# Altium schematic sheet IPG-V1_rev0.24.SchDoc (part 1 of 3)
size E; CompanyName: Medipace Inc.; Address2: Pasadena, CA; Address3: USA; Revision: 1
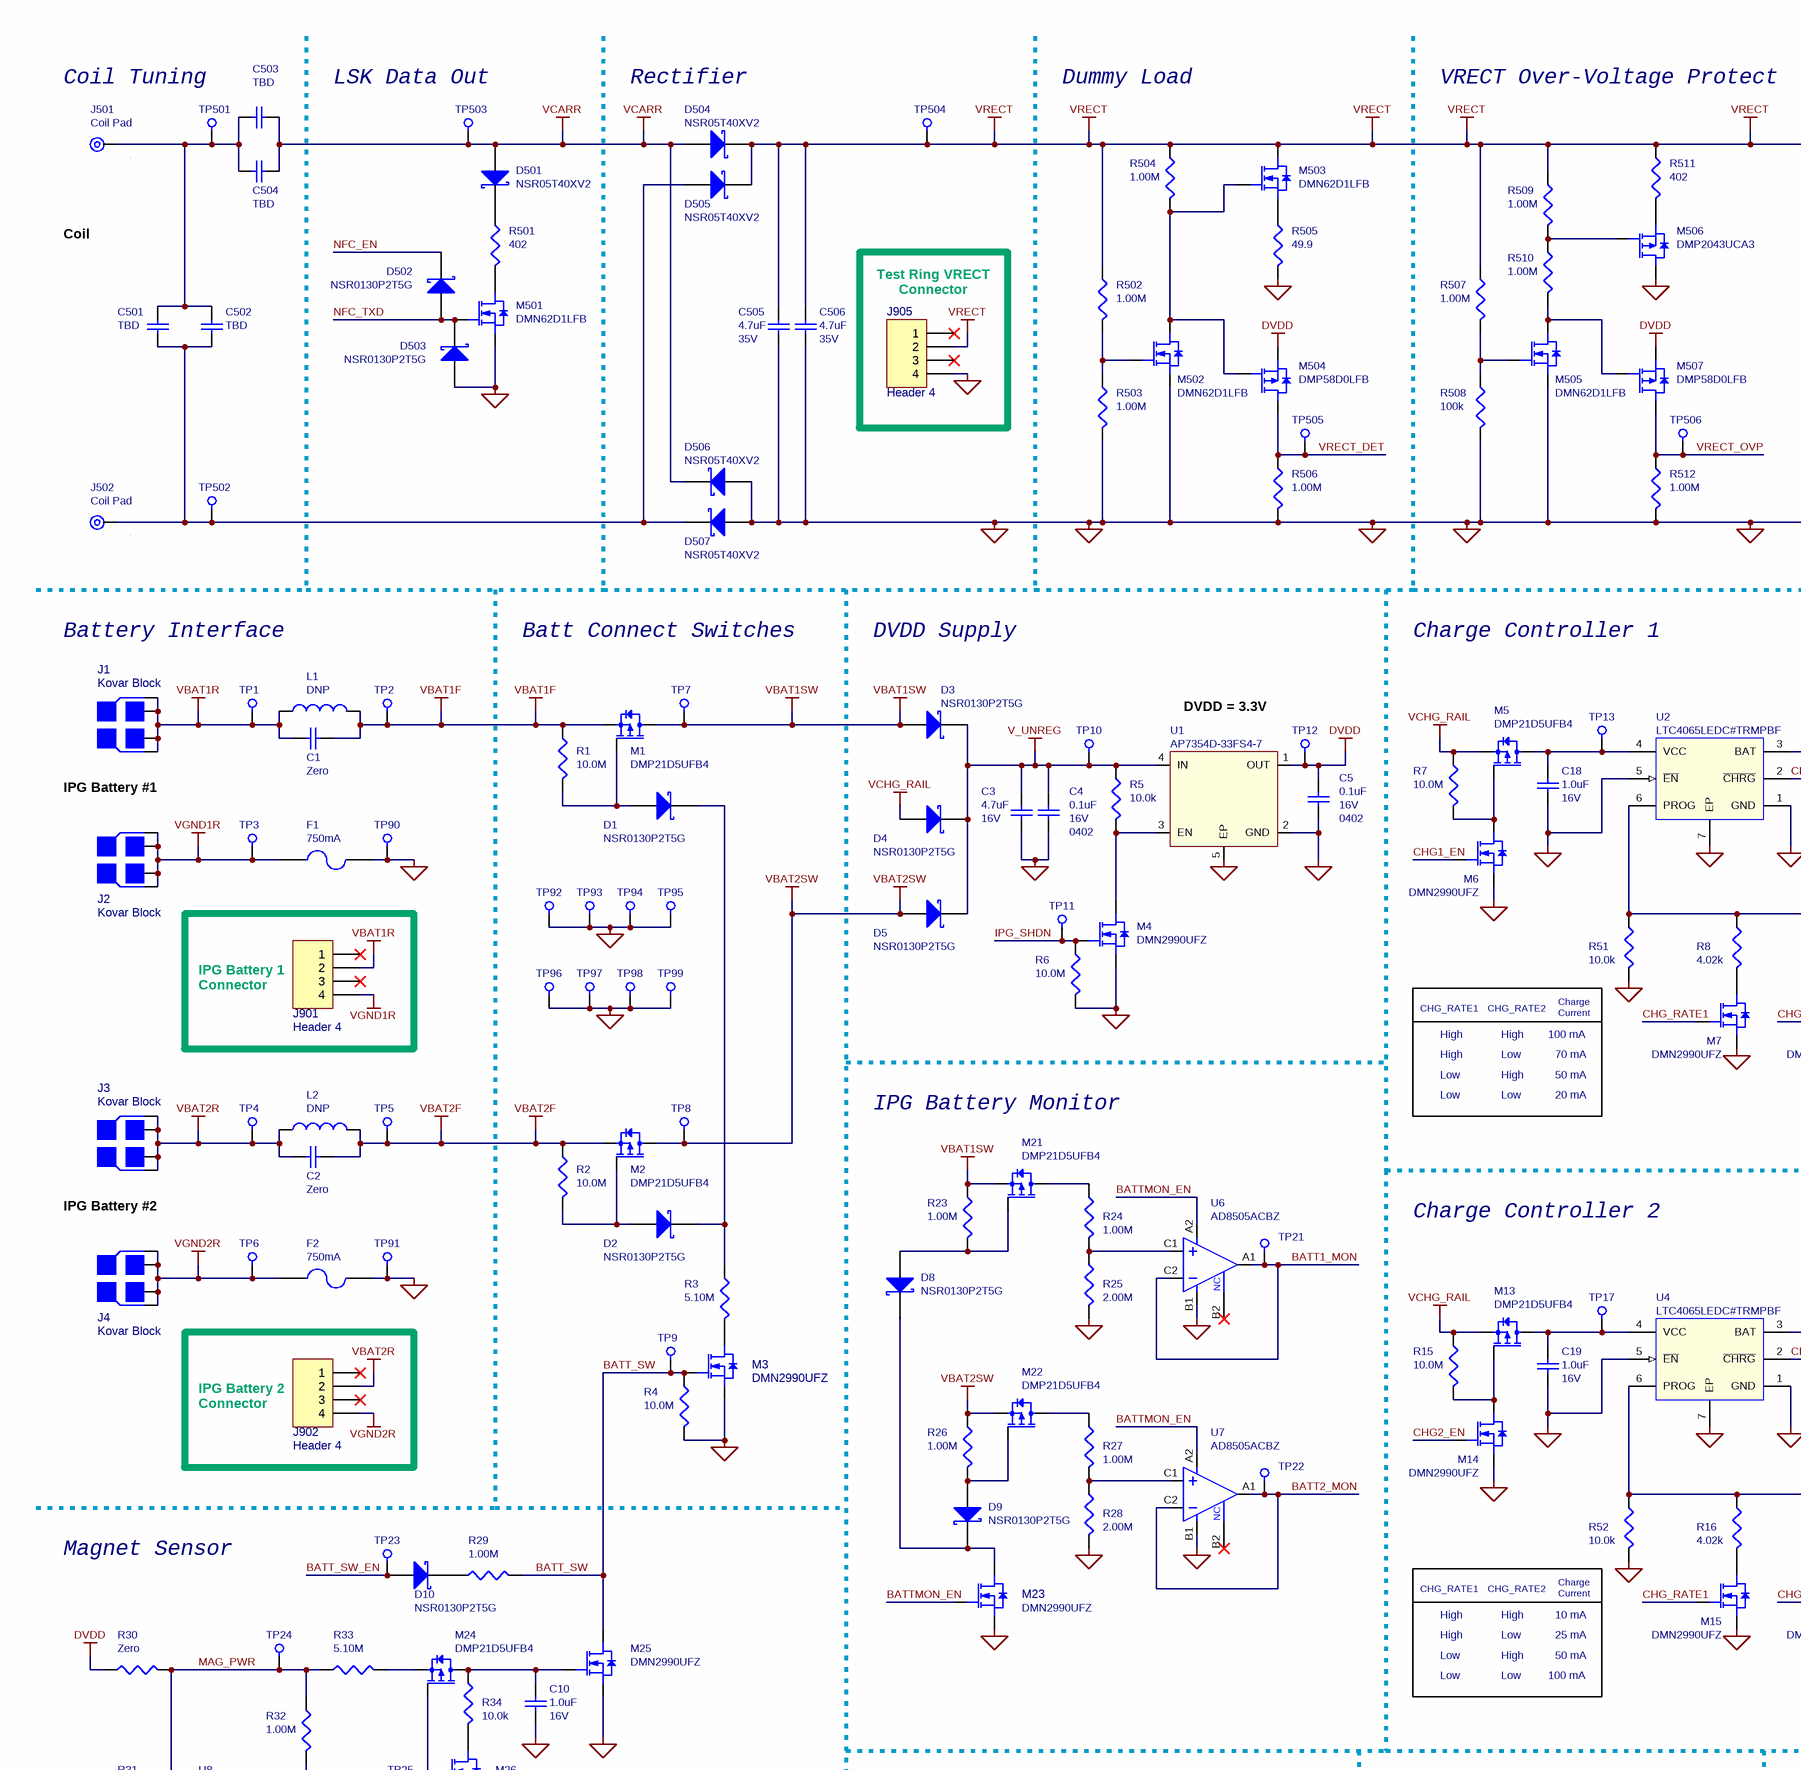
[diagram p0: IPG-V1_rev0.24.SchDoc, top left]
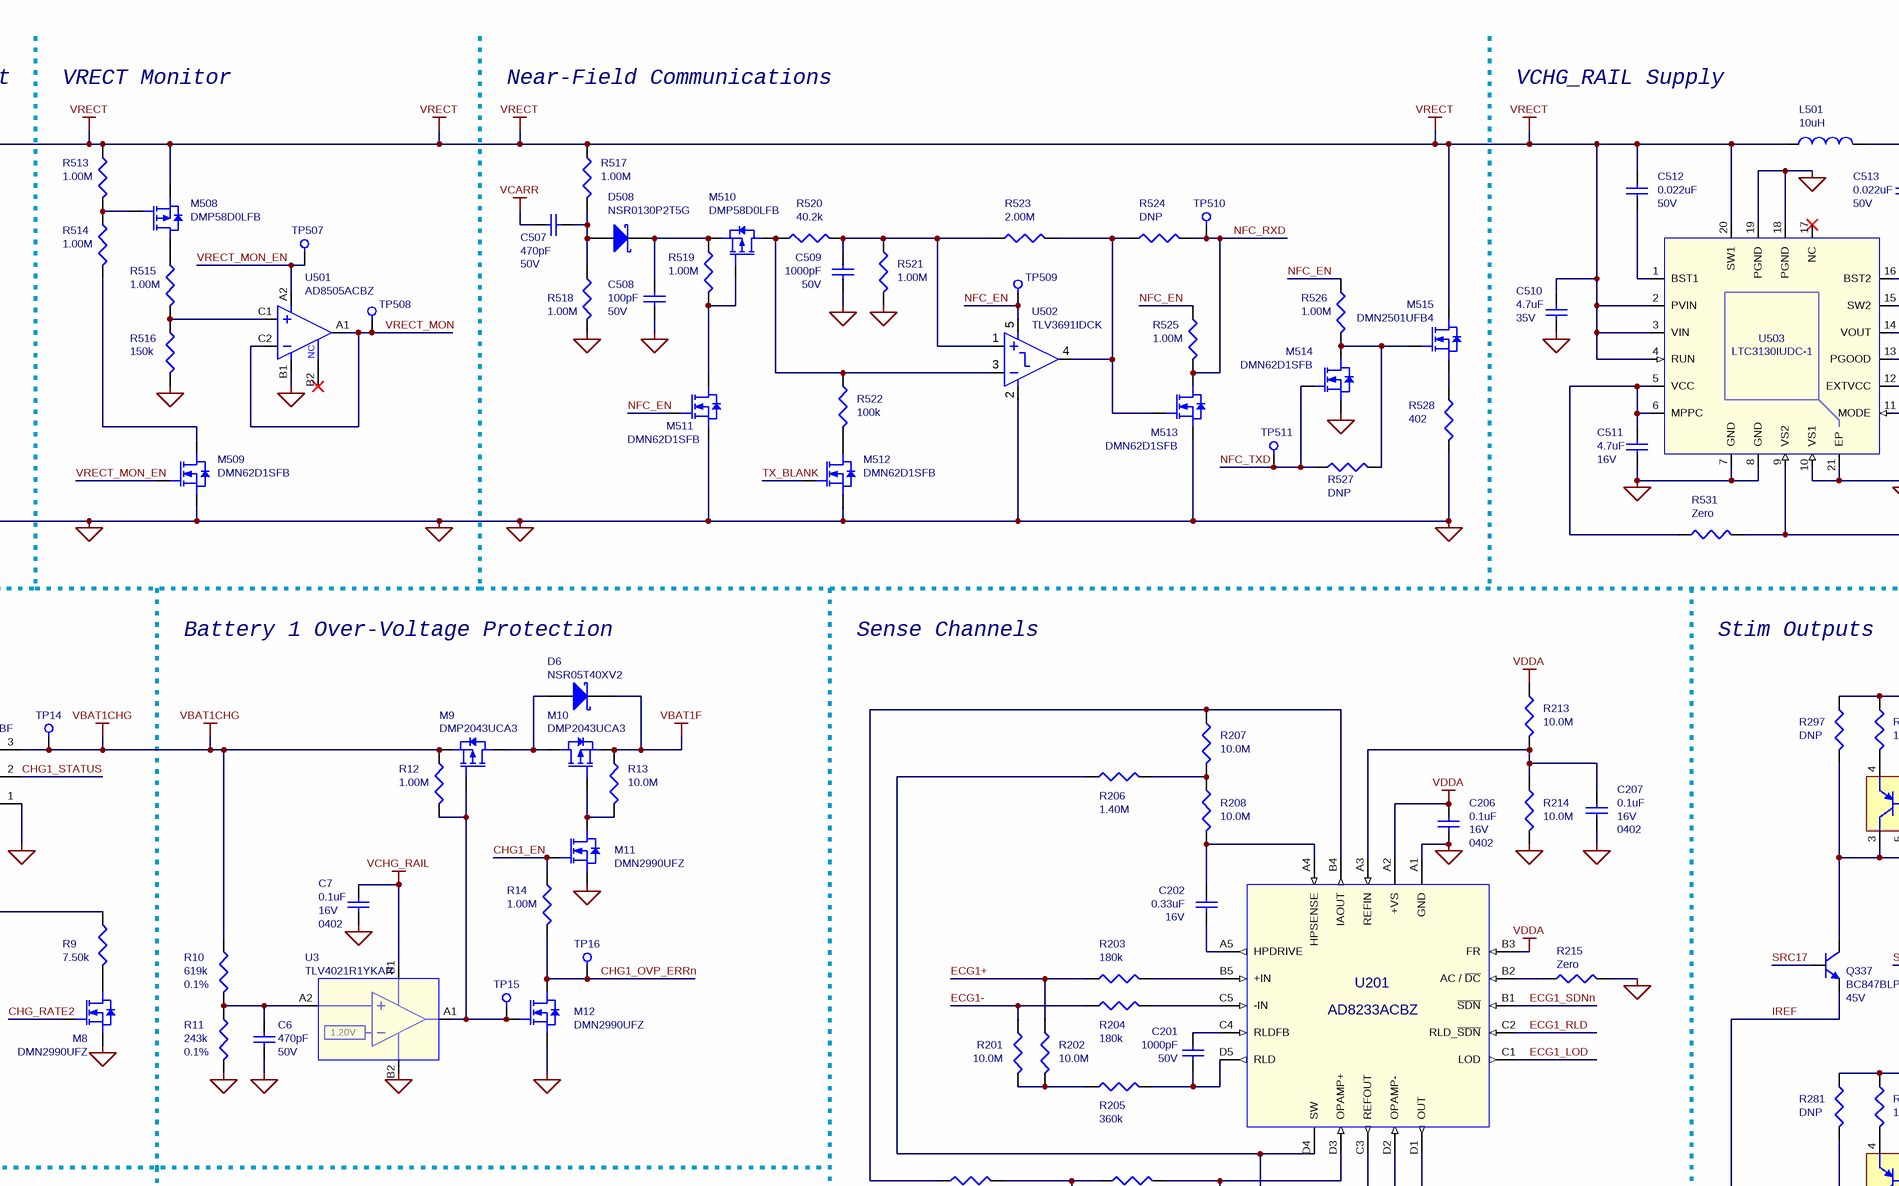
[diagram p1: IPG-V1_rev0.24.SchDoc, top middle]
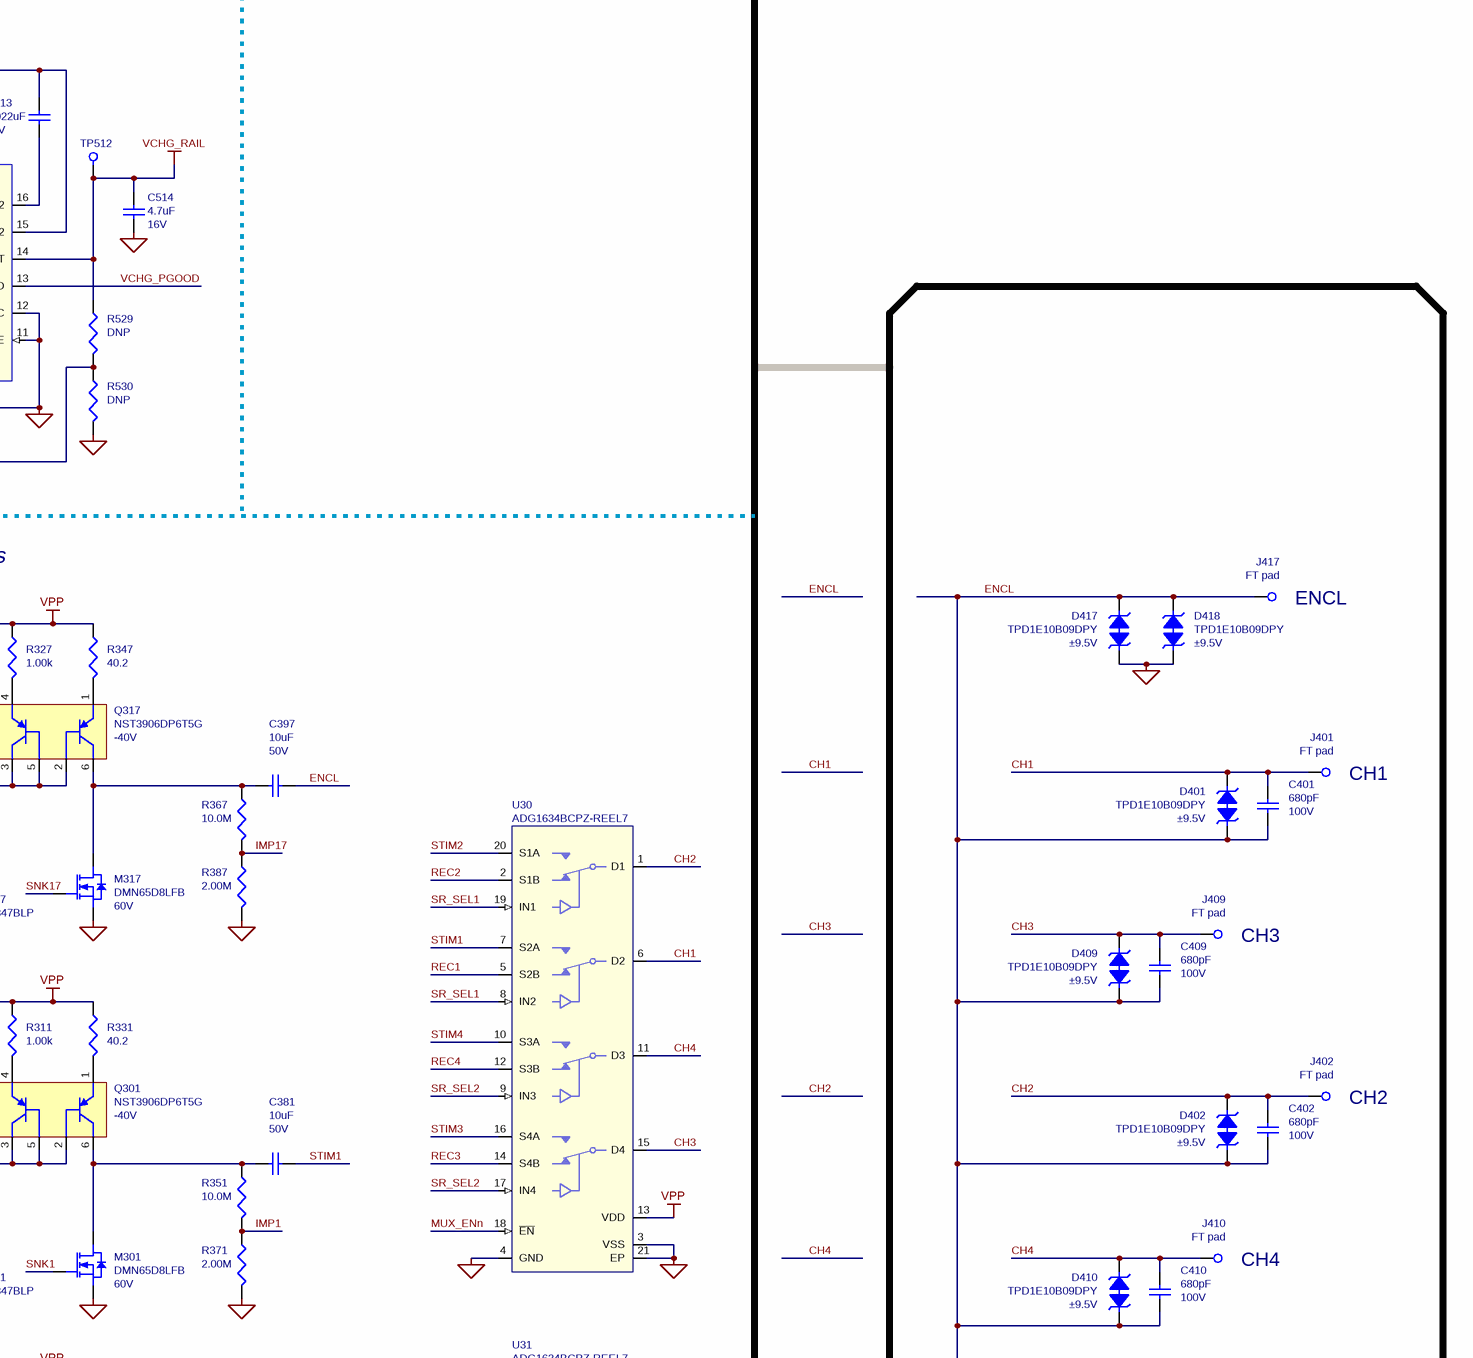
[diagram p2: IPG-V1_rev0.24.SchDoc, top right]
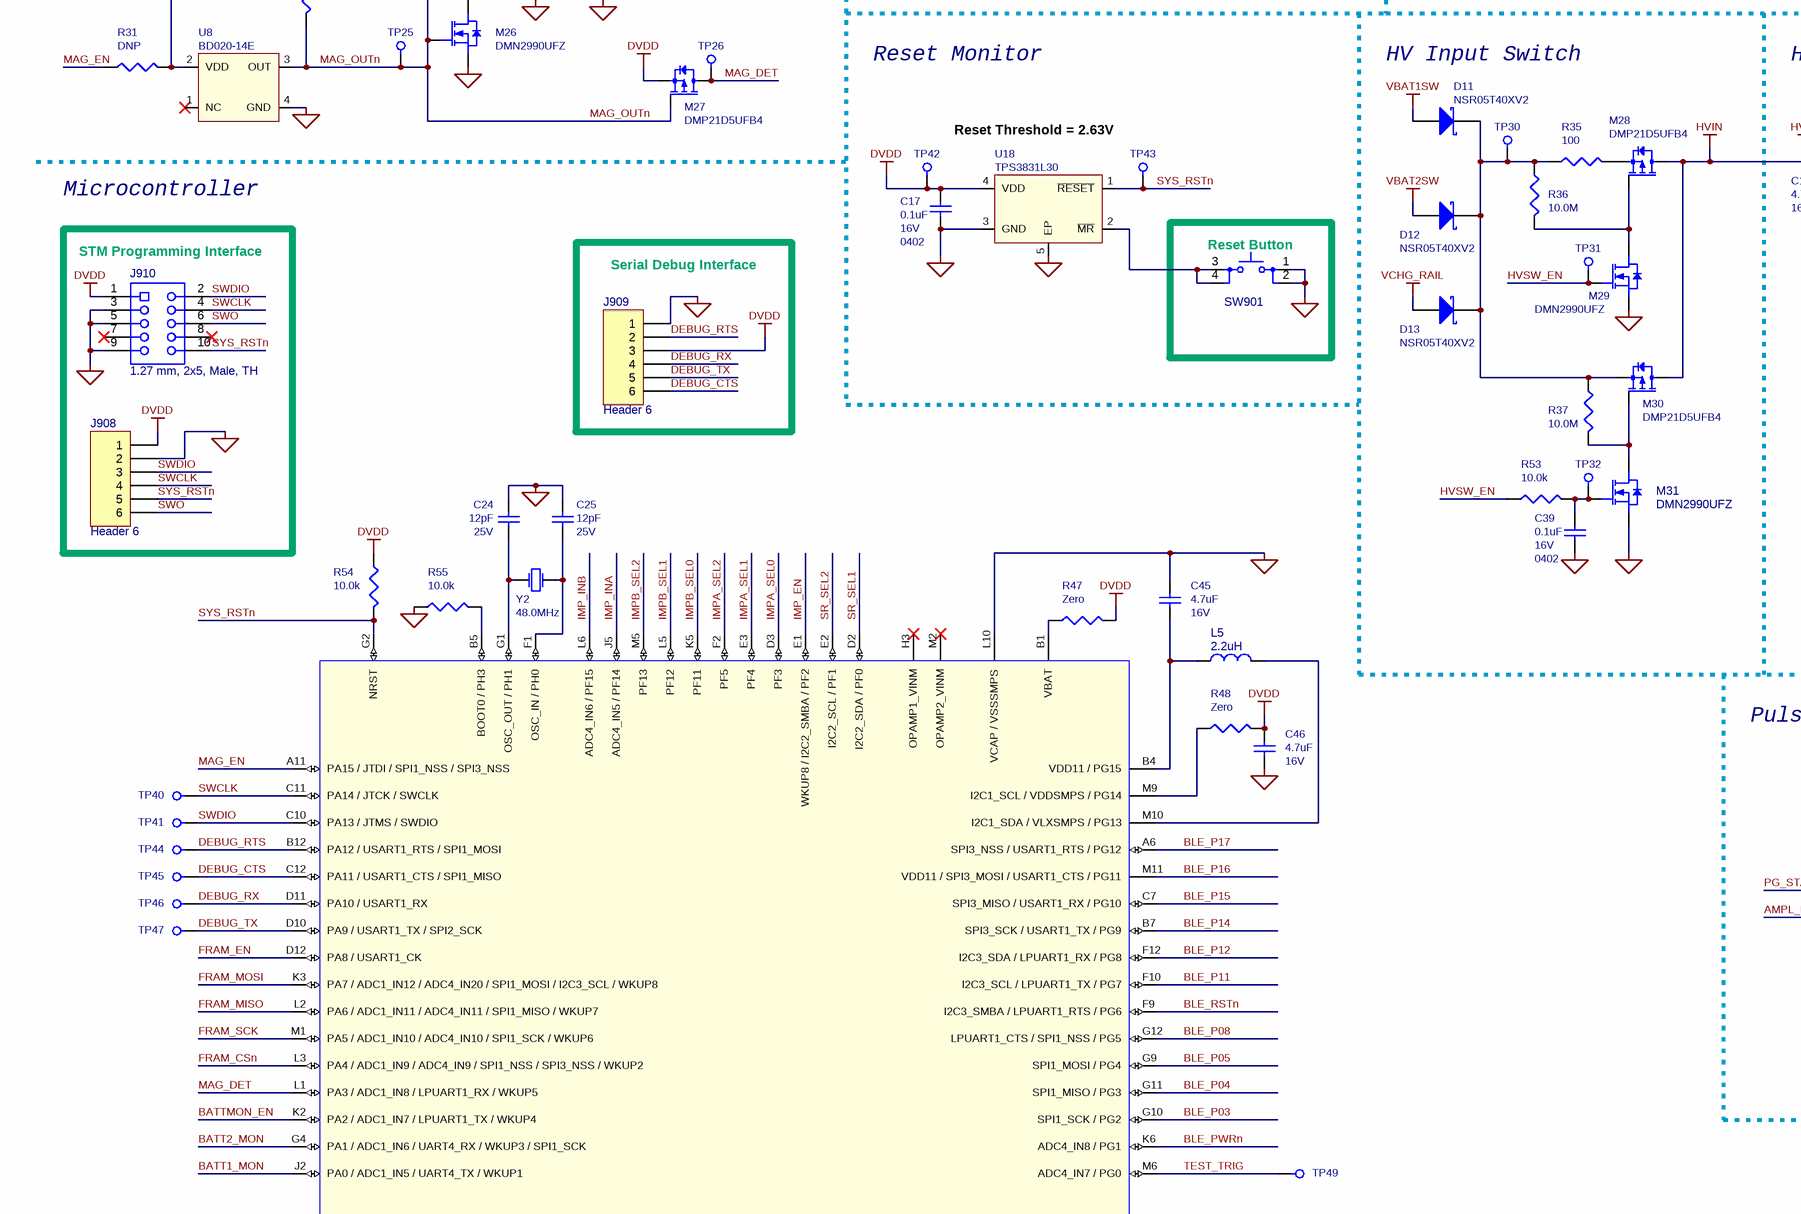
[diagram p3: IPG-V1_rev0.24.SchDoc, centre left]
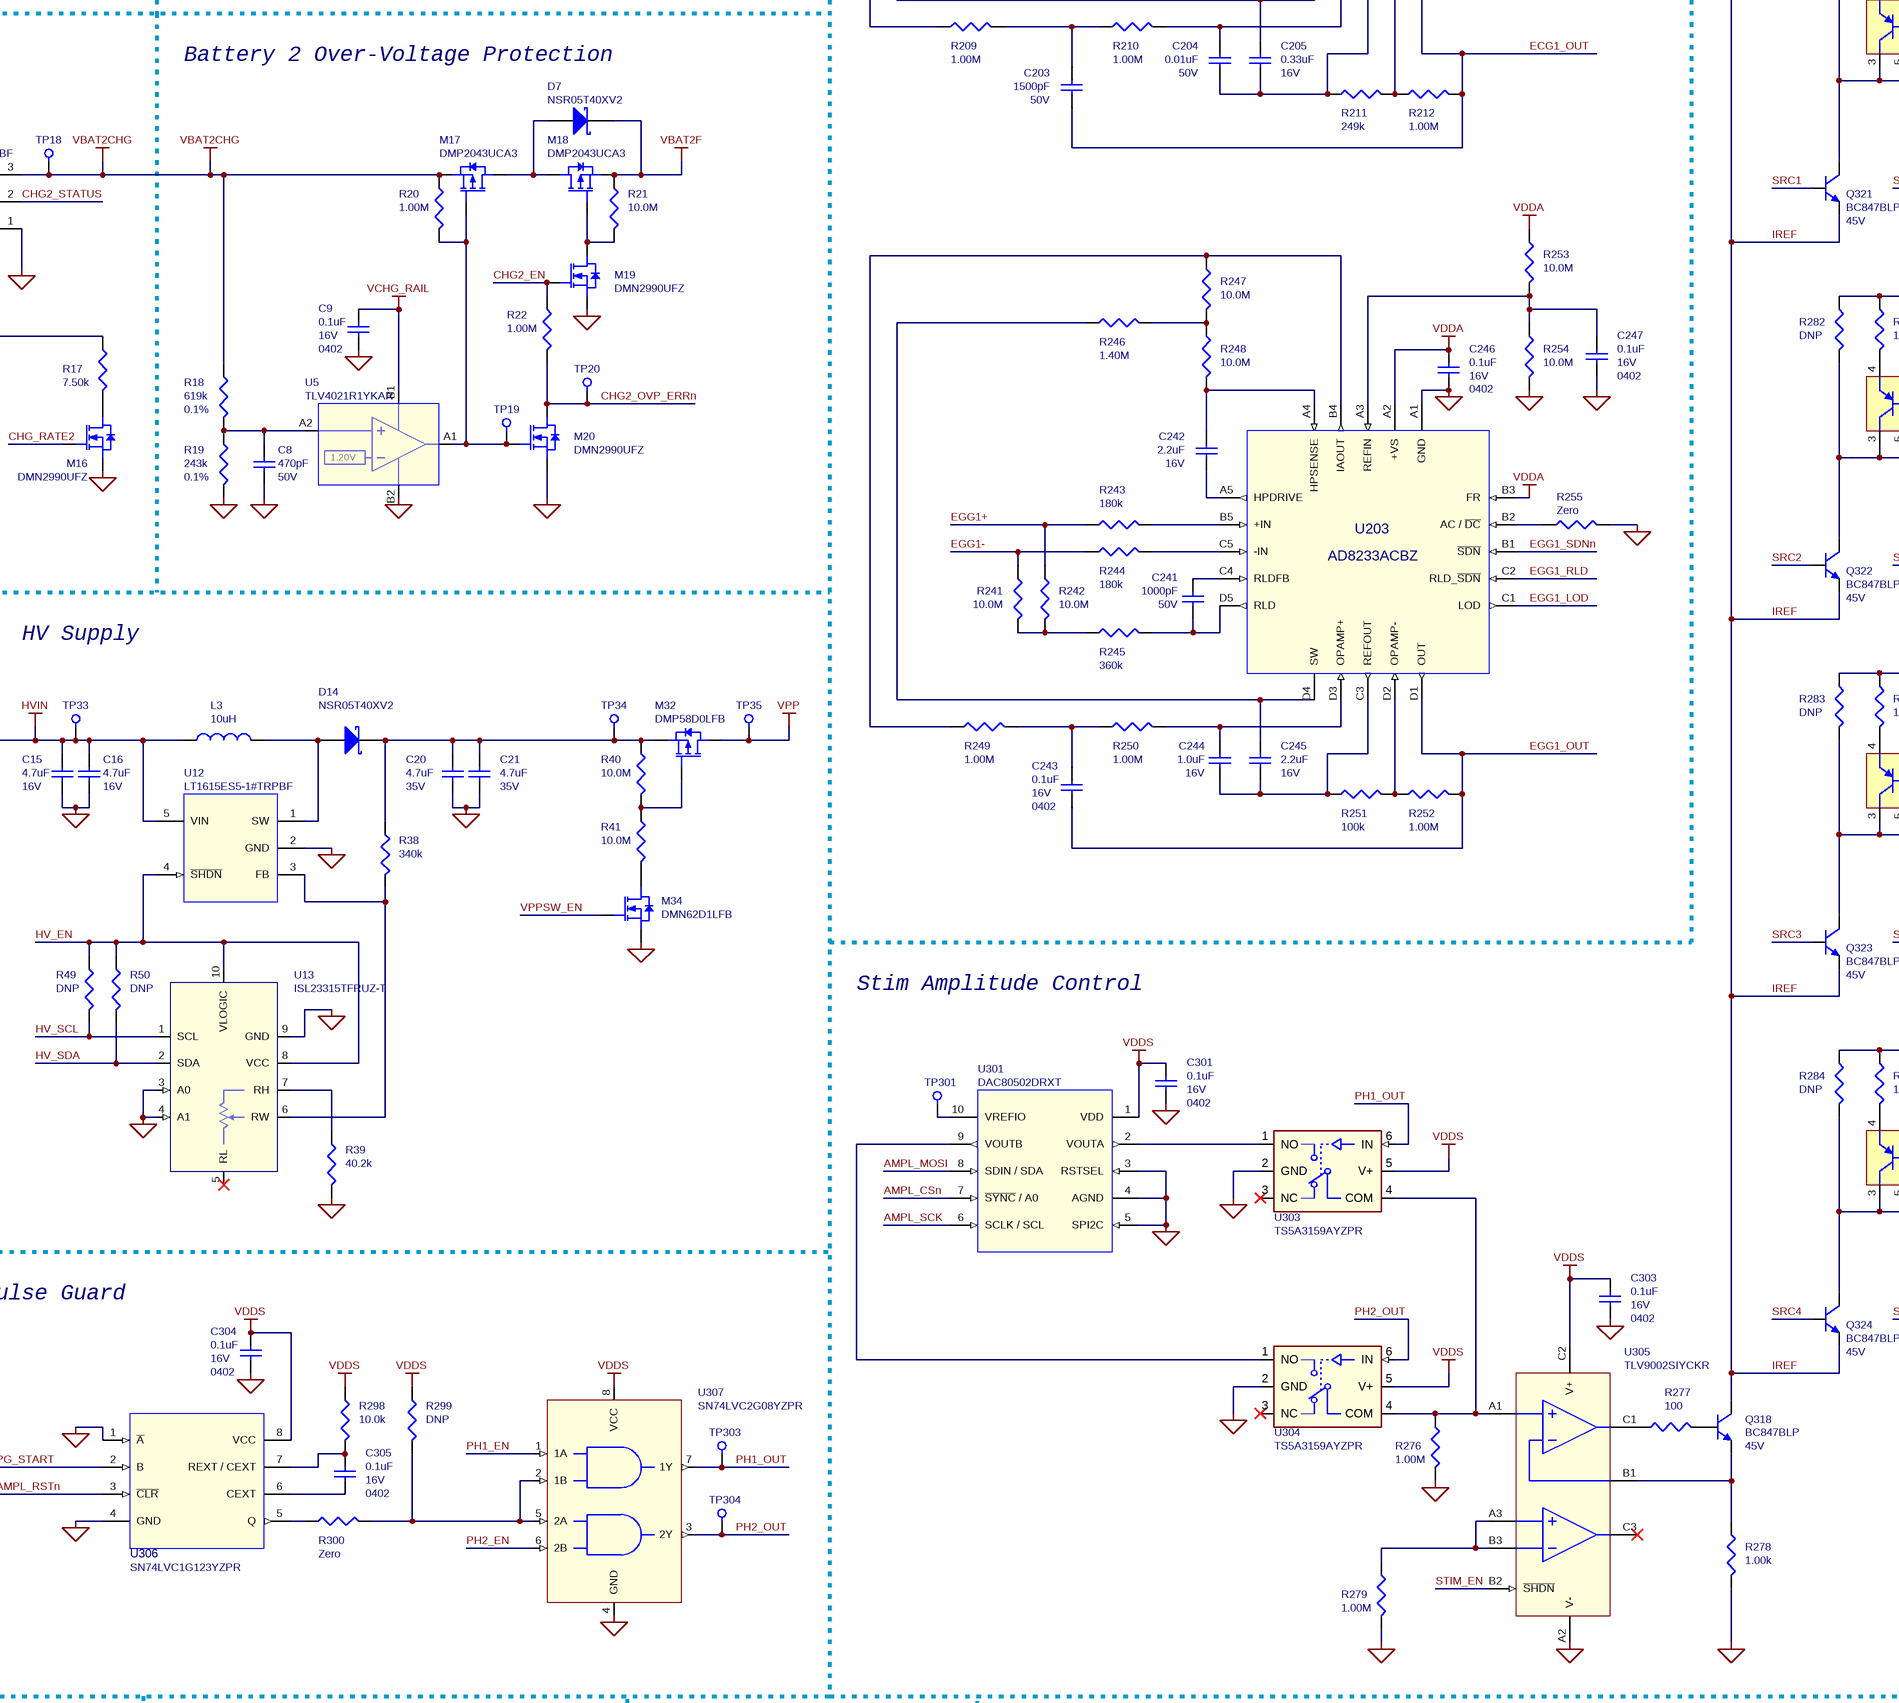
[diagram p4: IPG-V1_rev0.24.SchDoc, centre middle]
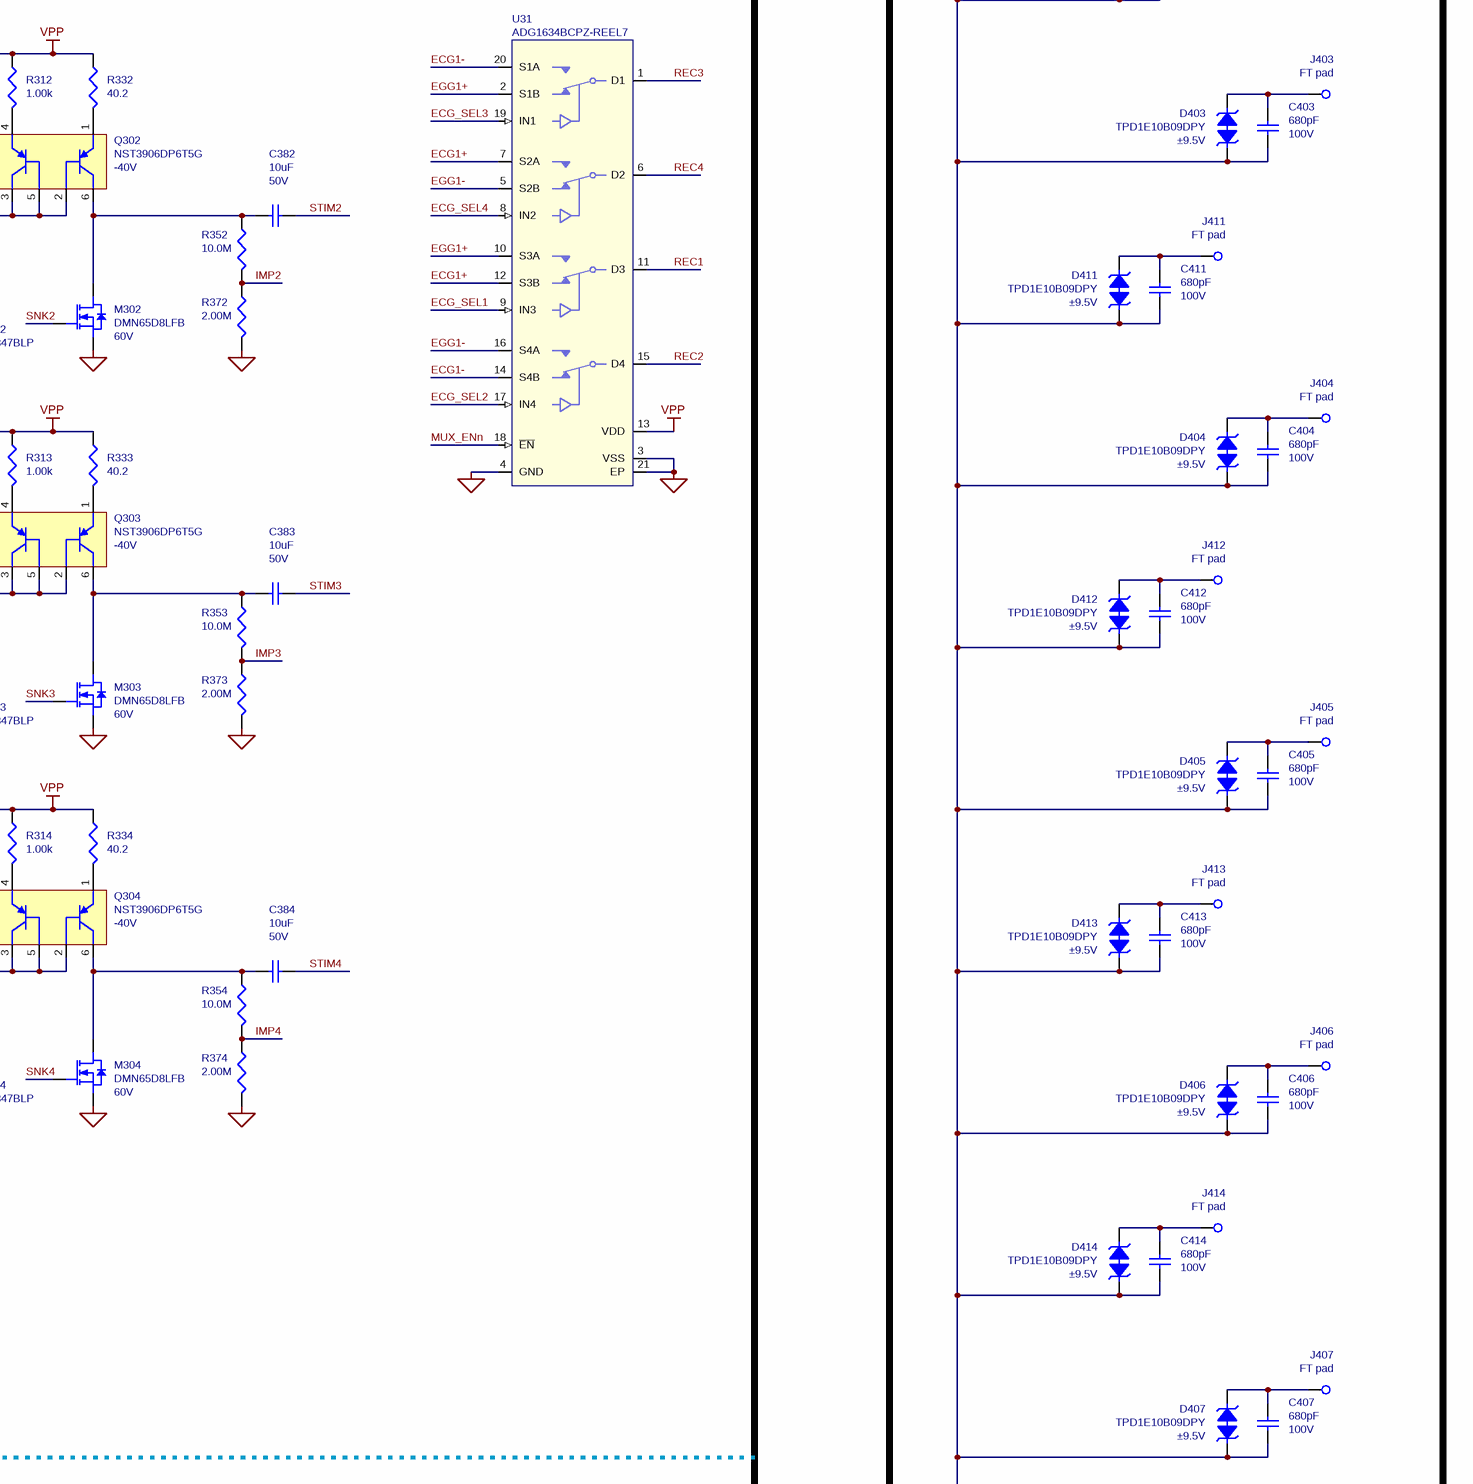
[diagram p5: IPG-V1_rev0.24.SchDoc, centre right]
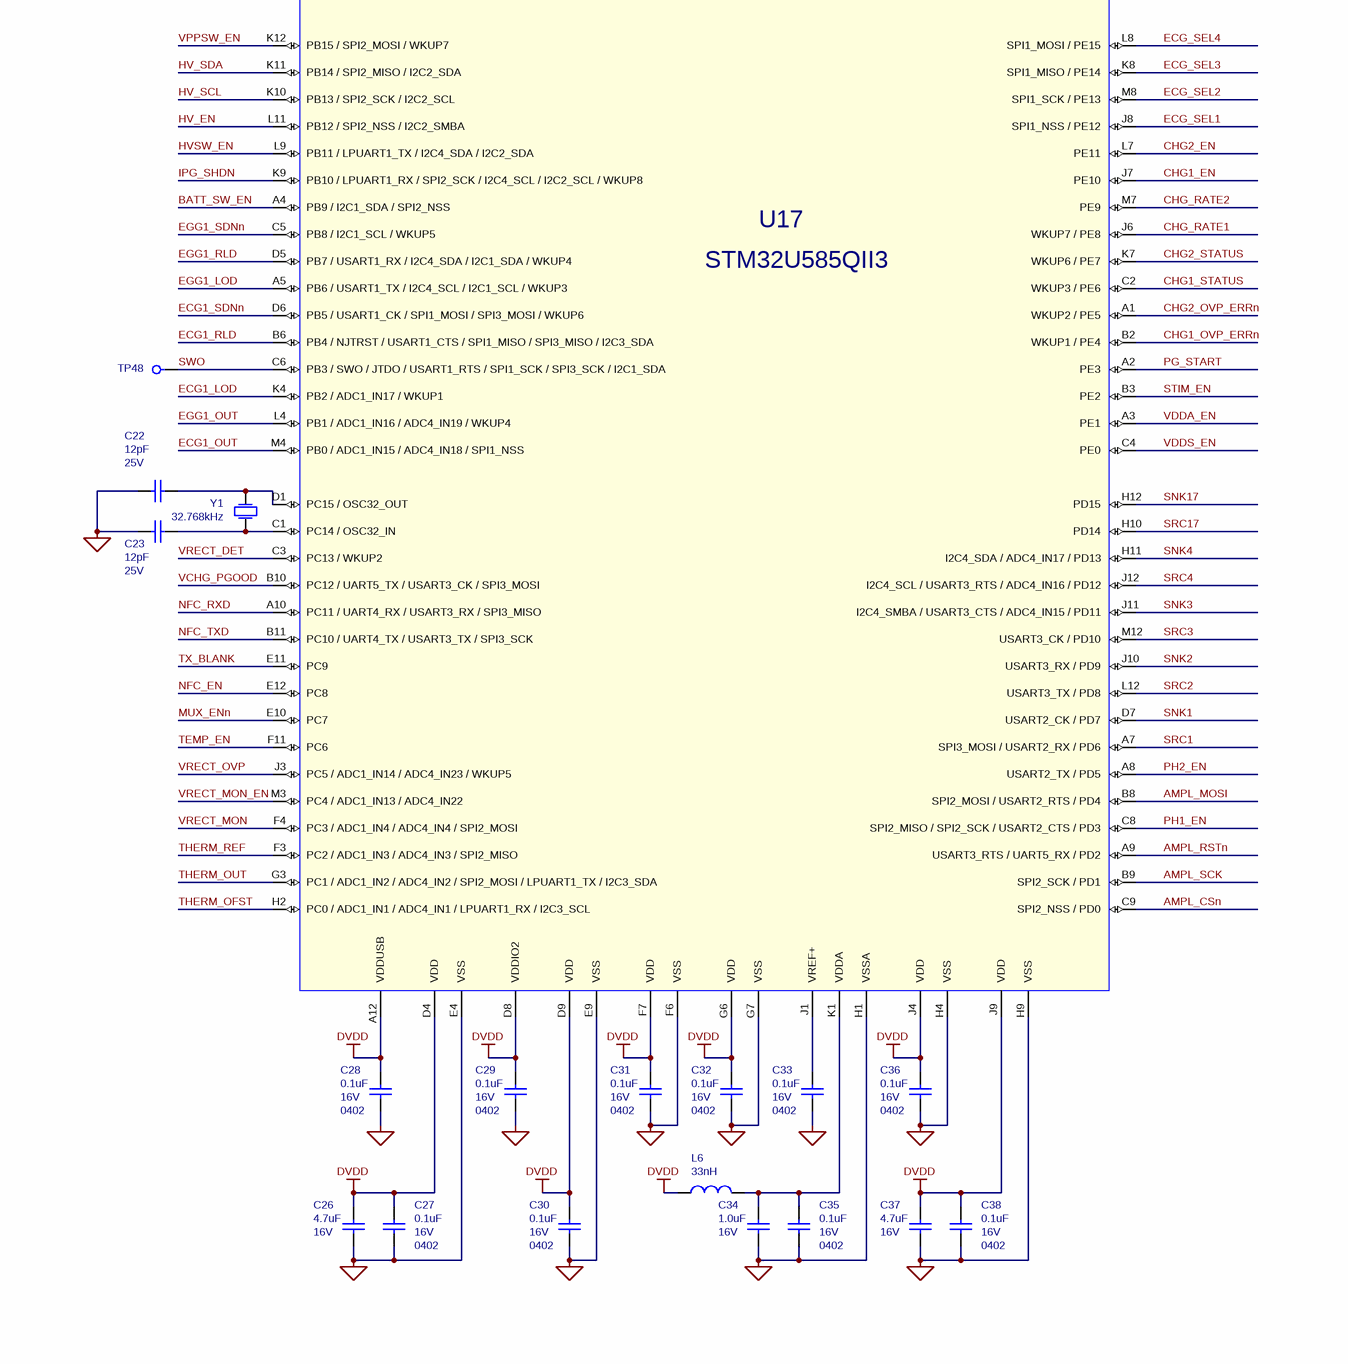
[diagram p6: IPG-V1_rev0.24.SchDoc, bottom left]
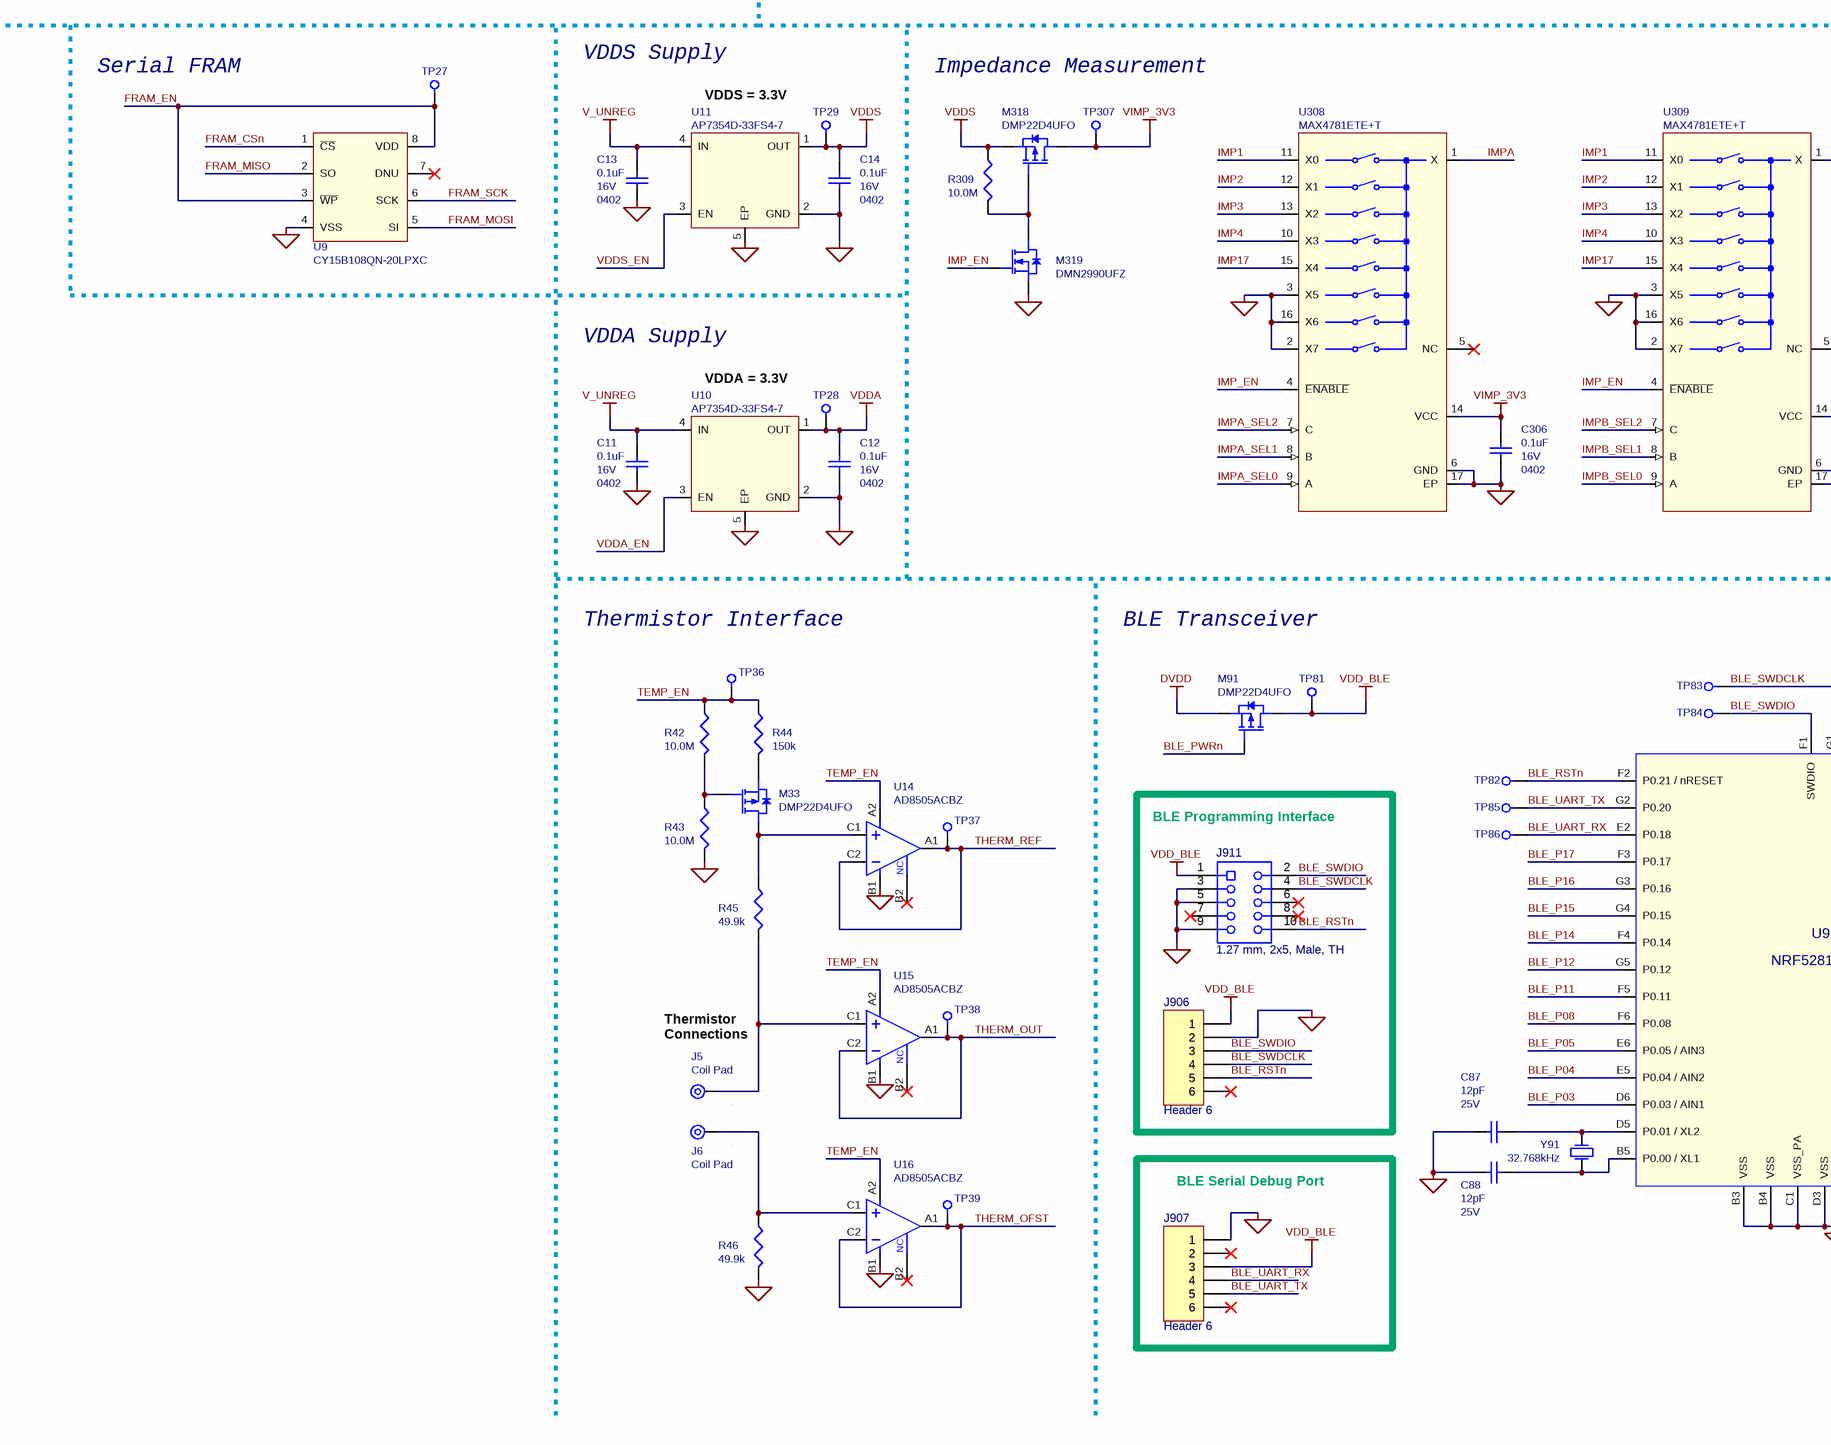
[diagram p7: IPG-V1_rev0.24.SchDoc, bottom middle]
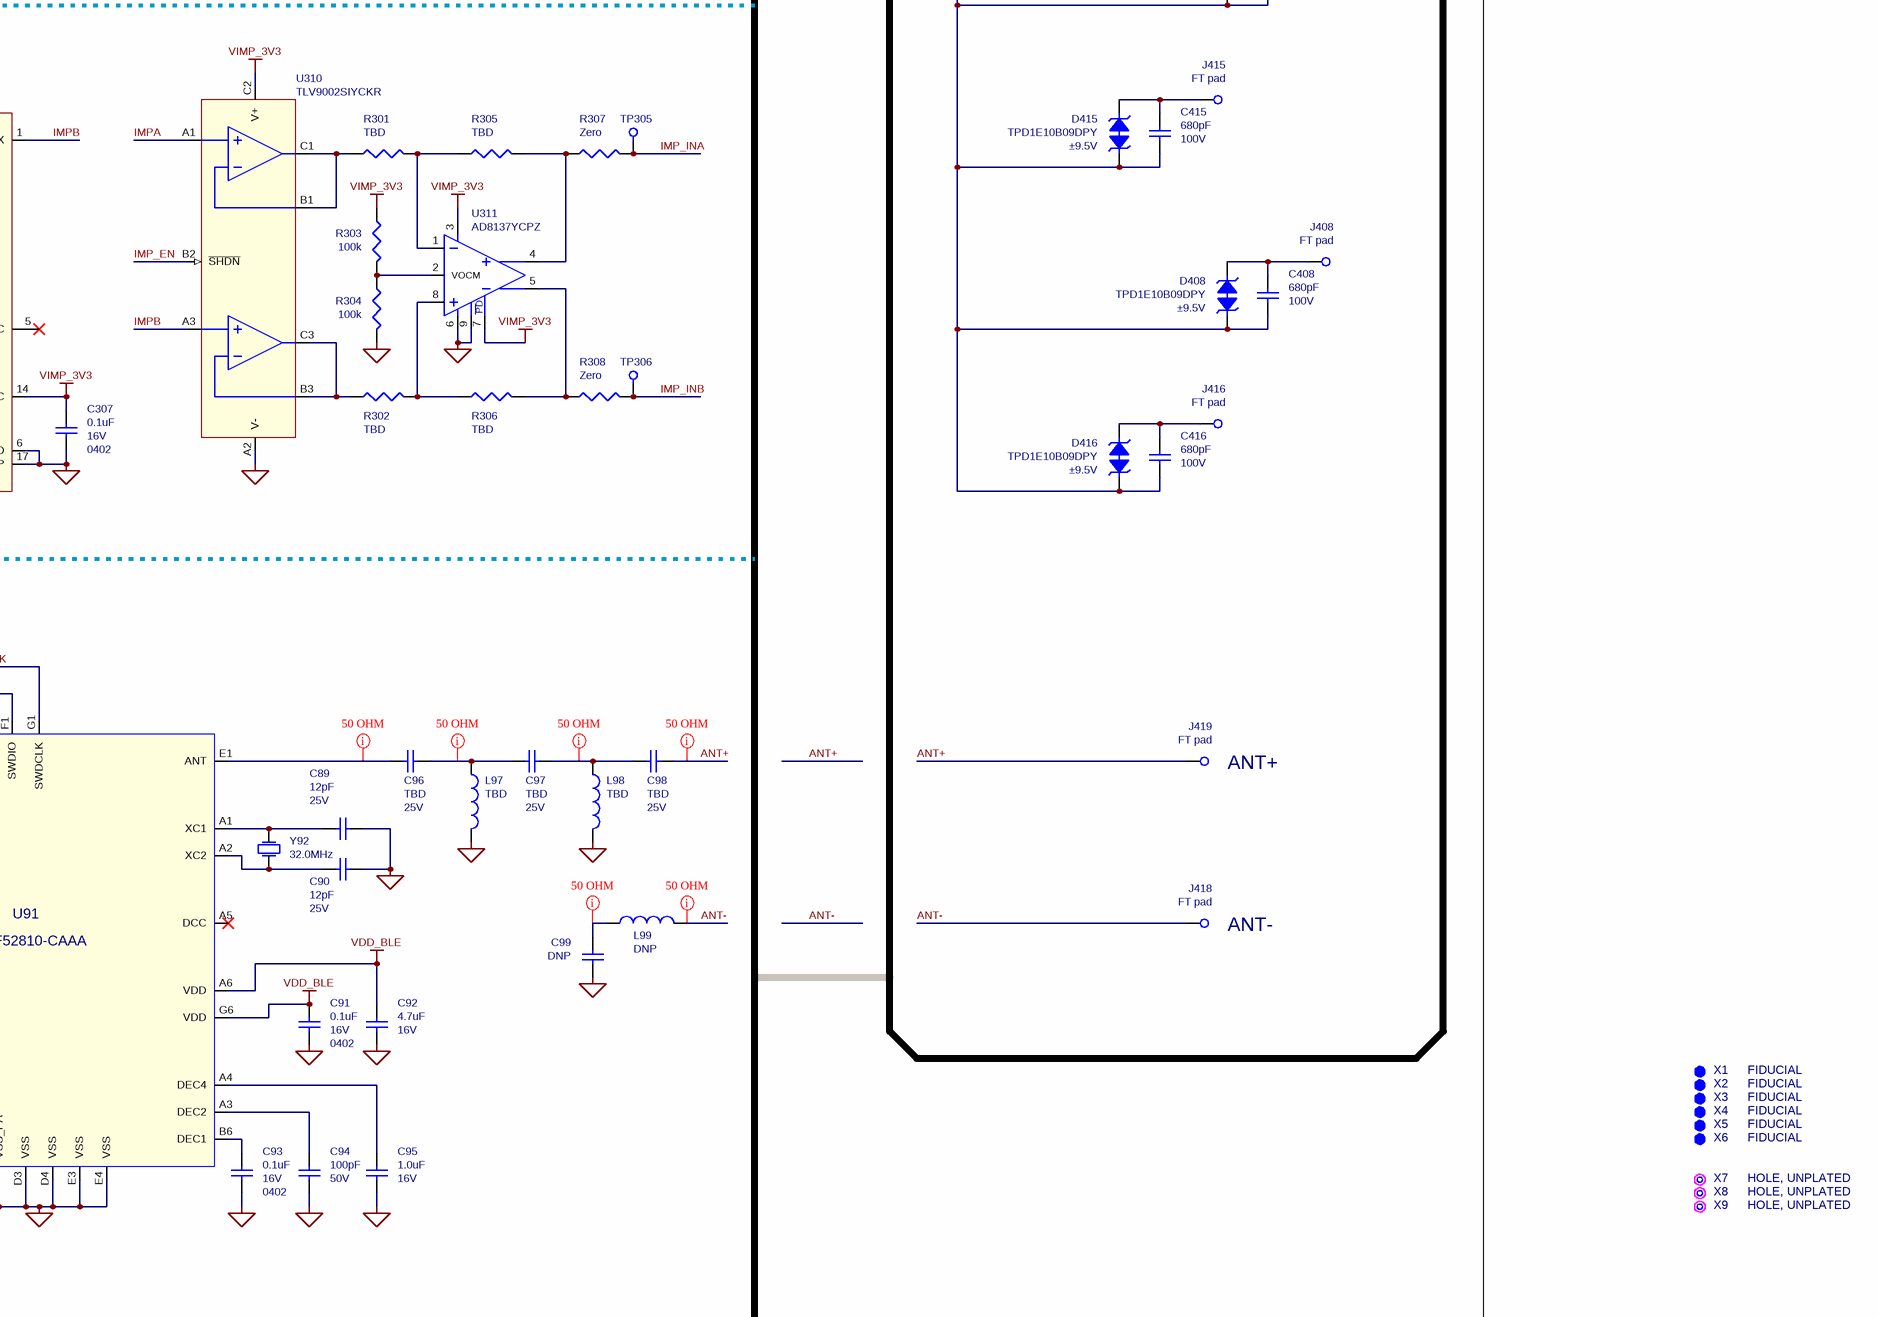
[diagram p8: IPG-V1_rev0.24.SchDoc, bottom right]

## Parts
C1  value Zero  [CAP0402_REDUCED]  (hidden comment: Capacitor, Zero ohms, 0402)
C2  value Zero  [CAP0402_REDUCED]  (hidden comment: Capacitor, Zero ohms, 0402)
C3  value 4.7uF  Rating: 16V  [CAP0603_REDUCED]  (hidden comment: GCH188R61C475KE11)
C4  value 0.1uF  Rating: 16V  Package Description: 0402  [CAP0402_REDUCED]  (hidden comment: GCH155R71C104KE01)
C5  value 0.1uF  Rating: 16V  Package Description: 0402  [CAP0402_REDUCED]  (hidden comment: GCH155R71C104KE01)
C6  value 470pF  Rating: 50V  [CAP0402_REDUCED]  (hidden comment: GCH155R71H471KE01)
C7  value 0.1uF  Rating: 16V  Package Description: 0402  [CAP0402_REDUCED]  (hidden comment: GCH155R71C104KE01)
C8  value 470pF  Rating: 50V  [CAP0402_REDUCED]  (hidden comment: GCH155R71H471KE01)
C9  value 0.1uF  Rating: 16V  Package Description: 0402  [CAP0402_REDUCED]  (hidden comment: GCH155R71C104KE01)
C10  value 1.0uF  Rating: 16V  [CAP0603_REDUCED]  (hidden comment: GCH188R71C105KE01)
C11  value 0.1uF  Rating: 16V  Package Description: 0402  [CAP0402_REDUCED]  (hidden comment: GCH155R71C104KE01)
C12  value 0.1uF  Rating: 16V  Package Description: 0402  [CAP0402_REDUCED]  (hidden comment: GCH155R71C104KE01)
C13  value 0.1uF  Rating: 16V  Package Description: 0402  [CAP0402_REDUCED]  (hidden comment: GCH155R71C104KE01)
C14  value 0.1uF  Rating: 16V  Package Description: 0402  [CAP0402_REDUCED]  (hidden comment: GCH155R71C104KE01)
C15  value 4.7uF  Rating: 16V  [CAP0603_REDUCED]  (hidden comment: GCH188R61C475KE11)
C16  value 4.7uF  Rating: 16V  [CAP0603_REDUCED]  (hidden comment: GCH188R61C475KE11)
C17  value 0.1uF  Rating: 16V  Package Description: 0402  [CAP0402_REDUCED]  (hidden comment: GCH155R71C104KE01)
C18  value 1.0uF  Rating: 16V  [CAP0603_REDUCED]  (hidden comment: GCH188R71C105KE01)
C19  value 1.0uF  Rating: 16V  [CAP0603_REDUCED]  (hidden comment: GCH188R71C105KE01)
C20  value 4.7uF  Rating: 35V  [CAP0805_REDUCED]  (hidden comment: GCH21BC7YA475KE11)
C21  value 4.7uF  Rating: 35V  [CAP0805_REDUCED]  (hidden comment: GCH21BC7YA475KE11)
C22  value 12pF  Rating: 25V  [CAP0402_REDUCED]  (hidden comment: C0402C120J3GACAUTO)
C23  value 12pF  Rating: 25V  [CAP0402_REDUCED]  (hidden comment: C0402C120J3GACAUTO)
C24  value 12pF  Rating: 25V  [CAP0402_REDUCED]  (hidden comment: C0402C120J3GACAUTO)
C25  value 12pF  Rating: 25V  [CAP0402_REDUCED]  (hidden comment: C0402C120J3GACAUTO)
C26  value 4.7uF  Rating: 16V  [CAP0603_REDUCED]  (hidden comment: GCH188R61C475KE11)
C27  value 0.1uF  Rating: 16V  Package Description: 0402  [CAP0402_REDUCED]  (hidden comment: GCH155R71C104KE01)
C28  value 0.1uF  Rating: 16V  Package Description: 0402  [CAP0402_REDUCED]  (hidden comment: GCH155R71C104KE01)
C29  value 0.1uF  Rating: 16V  Package Description: 0402  [CAP0402_REDUCED]  (hidden comment: GCH155R71C104KE01)
C30  value 0.1uF  Rating: 16V  Package Description: 0402  [CAP0402_REDUCED]  (hidden comment: GCH155R71C104KE01)
C31  value 0.1uF  Rating: 16V  Package Description: 0402  [CAP0402_REDUCED]  (hidden comment: GCH155R71C104KE01)
C32  value 0.1uF  Rating: 16V  Package Description: 0402  [CAP0402_REDUCED]  (hidden comment: GCH155R71C104KE01)
C33  value 0.1uF  Rating: 16V  Package Description: 0402  [CAP0402_REDUCED]  (hidden comment: GCH155R71C104KE01)
C34  value 1.0uF  Rating: 16V  [CAP0603_REDUCED]  (hidden comment: GCH188R71C105KE01)
C35  value 0.1uF  Rating: 16V  Package Description: 0402  [CAP0402_REDUCED]  (hidden comment: GCH155R71C104KE01)
C36  value 0.1uF  Rating: 16V  Package Description: 0402  [CAP0402_REDUCED]  (hidden comment: GCH155R71C104KE01)
C37  value 4.7uF  Rating: 16V  [CAP0603_REDUCED]  (hidden comment: GCH188R61C475KE11)
C38  value 0.1uF  Rating: 16V  Package Description: 0402  [CAP0402_REDUCED]  (hidden comment: GCH155R71C104KE01)
C39  value 0.1uF  Rating: 16V  Package Description: 0402  [CAP0402_REDUCED]  (hidden comment: GCH155R71C104KE01)
C45  value 4.7uF  Rating: 16V  [CAP0603_REDUCED]  (hidden comment: GCH188R61C475KE11)
C46  value 4.7uF  Rating: 16V  [CAP0603_REDUCED]  (hidden comment: GCH188R61C475KE11)
C87  value 12pF  Rating: 25V  [CAP0402_REDUCED]  (hidden comment: C0402C120J3GACAUTO)
C88  value 12pF  Rating: 25V  [CAP0402_REDUCED]  (hidden comment: C0402C120J3GACAUTO)
C89  value 12pF  Rating: 25V  [CAP0402_REDUCED]  (hidden comment: C0402C120J3GACAUTO)
C90  value 12pF  Rating: 25V  [CAP0402_REDUCED]  (hidden comment: C0402C120J3GACAUTO)
C91  value 0.1uF  Rating: 16V  Package Description: 0402  [CAP0402_REDUCED]  (hidden comment: GCH155R71C104KE01)
C92  value 4.7uF  Rating: 16V  [CAP0603_REDUCED]  (hidden comment: GCH188R61C475KE11)
C93  value 0.1uF  Rating: 16V  Package Description: 0402  [CAP0402_REDUCED]  (hidden comment: GCH155R71C104KE01)
C94  value 100pF  Rating: 50V  [CAP0402_REDUCED]  (hidden comment: GCH1555C1H101JE01)
C95  value 1.0uF  Rating: 16V  [CAP0603_REDUCED]  (hidden comment: GCH188R71C105KE01)
C96  value TBD  Rating: 25V  [CAP0402_REDUCED]  (hidden comment: Capacitor, TBD, 0402)
C97  value TBD  Rating: 25V  [CAP0402_REDUCED]  (hidden comment: Capacitor, TBD, 0402)
C98  value TBD  Rating: 25V  [CAP0402_REDUCED]  (hidden comment: Capacitor, TBD, 0402)
C99  value DNP  [CAP0402_REDUCED]  (hidden comment: Capacitor, DNP, 0402)
C201  value 1000pF  Rating: 50V  [CAP0402_REDUCED]  (hidden comment: GRM1555C1H102JA01D)
C202  value 0.33uF  Rating: 16V  [CAP0402_REDUCED]  (hidden comment: CGA2B1X7S1C334K050BC)
C203  value 1500pF  Rating: 50V  [CAP0402_REDUCED]  (hidden comment: GCM155R71H152KA37D)
C204  value 0.01uF  Rating: 50V  [CAP0402_REDUCED]  (hidden comment: GCH155R71H103KE01)
C205  value 0.33uF  Rating: 16V  [CAP0402_REDUCED]  (hidden comment: CGA2B1X7S1C334K050BC)
C206  value 0.1uF  Rating: 16V  Package Description: 0402  [CAP0402_REDUCED]  (hidden comment: GCH155R71C104KE01)
C207  value 0.1uF  Rating: 16V  Package Description: 0402  [CAP0402_REDUCED]  (hidden comment: GCH155R71C104KE01)
C241  value 1000pF  Rating: 50V  [CAP0402_REDUCED]  (hidden comment: GRM1555C1H102JA01D)
C242  value 2.2uF  Rating: 16V  [CAP0603_REDUCED]  (hidden comment: GRM188Z71C225ME43J)
C243  value 0.1uF  Rating: 16V  Package Description: 0402  [CAP0402_REDUCED]  (hidden comment: GCH155R71C104KE01)
C244  value 1.0uF  Rating: 16V  [CAP0603_REDUCED]  (hidden comment: GCH188R71C105KE01)
C245  value 2.2uF  Rating: 16V  [CAP0603_REDUCED]  (hidden comment: GRM188Z71C225ME43J)
C246  value 0.1uF  Rating: 16V  Package Description: 0402  [CAP0402_REDUCED]  (hidden comment: GCH155R71C104KE01)
C247  value 0.1uF  Rating: 16V  Package Description: 0402  [CAP0402_REDUCED]  (hidden comment: GCH155R71C104KE01)
C301  value 0.1uF  Rating: 16V  Package Description: 0402  [CAP0402_REDUCED]  (hidden comment: GCH155R71C104KE01)
C303  value 0.1uF  Rating: 16V  Package Description: 0402  [CAP0402_REDUCED]  (hidden comment: GCH155R71C104KE01)
C304  value 0.1uF  Rating: 16V  Package Description: 0402  [CAP0402_REDUCED]  (hidden comment: GCH155R71C104KE01)
C305  value 0.1uF  Rating: 16V  Package Description: 0402  [CAP0402_REDUCED]  (hidden comment: GCH155R71C104KE01)
C306  value 0.1uF  Rating: 16V  Package Description: 0402  [CAP0402_REDUCED]  (hidden comment: GCH155R71C104KE01)
C307  value 0.1uF  Rating: 16V  Package Description: 0402  [CAP0402_REDUCED]  (hidden comment: GCH155R71C104KE01)
C381  value 10uF  Rating: 50V  [CAP0805_REDUCED]  (hidden comment: GRM21BR61H106ME43L)
C382  value 10uF  Rating: 50V  [CAP0805_REDUCED]  (hidden comment: GRM21BR61H106ME43L)
C383  value 10uF  Rating: 50V  [CAP0805_REDUCED]  (hidden comment: GRM21BR61H106ME43L)
C384  value 10uF  Rating: 50V  [CAP0805_REDUCED]  (hidden comment: GRM21BR61H106ME43L)
C397  value 10uF  Rating: 50V  [CAP0805_REDUCED]  (hidden comment: GRM21BR61H106ME43L)
C401  value 680pF  Rating: 100V  [CAP0402_REDUCED]  (hidden comment: C1005C0G2A681J050BE)
C402  value 680pF  Rating: 100V  [CAP0402_REDUCED]  (hidden comment: C1005C0G2A681J050BE)
C403  value 680pF  Rating: 100V  [CAP0402_REDUCED]  (hidden comment: C1005C0G2A681J050BE)
C404  value 680pF  Rating: 100V  [CAP0402_REDUCED]  (hidden comment: C1005C0G2A681J050BE)
C405  value 680pF  Rating: 100V  [CAP0402_REDUCED]  (hidden comment: C1005C0G2A681J050BE)
C406  value 680pF  Rating: 100V  [CAP0402_REDUCED]  (hidden comment: C1005C0G2A681J050BE)
C407  value 680pF  Rating: 100V  [CAP0402_REDUCED]  (hidden comment: C1005C0G2A681J050BE)
C408  value 680pF  Rating: 100V  [CAP0402_REDUCED]  (hidden comment: C1005C0G2A681J050BE)
C409  value 680pF  Rating: 100V  [CAP0402_REDUCED]  (hidden comment: C1005C0G2A681J050BE)
C410  value 680pF  Rating: 100V  [CAP0402_REDUCED]  (hidden comment: C1005C0G2A681J050BE)
C411  value 680pF  Rating: 100V  [CAP0402_REDUCED]  (hidden comment: C1005C0G2A681J050BE)
C412  value 680pF  Rating: 100V  [CAP0402_REDUCED]  (hidden comment: C1005C0G2A681J050BE)
C413  value 680pF  Rating: 100V  [CAP0402_REDUCED]  (hidden comment: C1005C0G2A681J050BE)
C414  value 680pF  Rating: 100V  [CAP0402_REDUCED]  (hidden comment: C1005C0G2A681J050BE)
C415  value 680pF  Rating: 100V  [CAP0402_REDUCED]  (hidden comment: C1005C0G2A681J050BE)
C416  value 680pF  Rating: 100V  [CAP0402_REDUCED]  (hidden comment: C1005C0G2A681J050BE)
C501  value TBD  [CAP0805_REDUCED]  (hidden comment: Capacitor, TBD, 0805)
C502  value TBD  [CAP0805_REDUCED]  (hidden comment: Capacitor, TBD, 0805)
C503  value TBD  [CAP0805_REDUCED]  (hidden comment: Capacitor, TBD, 0805)
C504  value TBD  [CAP0805_REDUCED]  (hidden comment: Capacitor, TBD, 0805)
C505  value 4.7uF  Rating: 35V  [CAP0805_REDUCED]  (hidden comment: GCH21BC7YA475KE11)
C506  value 4.7uF  Rating: 35V  [CAP0805_REDUCED]  (hidden comment: GCH21BC7YA475KE11)
C507  value 470pF  Rating: 50V  [CAP0402_REDUCED]  (hidden comment: GCH155R71H471KE01)
C508  value 100pF  Rating: 50V  [CAP0402_REDUCED]  (hidden comment: GCH1555C1H101JE01)
C509  value 1000pF  Rating: 50V  [CAP0402_REDUCED]  (hidden comment: GRM1555C1H102JA01D)
C510  value 4.7uF  Rating: 35V  [CAP0805_REDUCED]  (hidden comment: GCH21BC7YA475KE11)
C511  value 4.7uF  Rating: 16V  [CAP0603_REDUCED]  (hidden comment: GCH188R61C475KE11)
C512  value 0.022uF  Rating: 50V  [CAP0402_REDUCED]  (hidden comment: GCH155R71H223KE01)
C513  value 0.022uF  Rating: 50V  [CAP0402_REDUCED]  (hidden comment: GCH155R71H223KE01)
C514  value 4.7uF  Rating: 16V  [CAP0603_REDUCED]  (hidden comment: GCH188R61C475KE11)
D1  NSR0130P2T5G  [ONSC_SOD-923_CASE514AB]
D2  NSR0130P2T5G  [ONSC_SOD-923_CASE514AB]
D3  NSR0130P2T5G  [ONSC_SOD-923_CASE514AB]
D4  NSR0130P2T5G  [ONSC_SOD-923_CASE514AB]
D5  NSR0130P2T5G  [ONSC_SOD-923_CASE514AB]
D6  NSR05T40XV2  [STM_SOD-523_REDUCED]
D7  NSR05T40XV2  [STM_SOD-523_REDUCED]
D8  NSR0130P2T5G  [ONSC_SOD-923_CASE514AB]
D9  NSR0130P2T5G  [ONSC_SOD-923_CASE514AB]
D10  NSR0130P2T5G  [ONSC_SOD-923_CASE514AB]
D11  NSR05T40XV2  [STM_SOD-523_REDUCED]
D12  NSR05T40XV2  [STM_SOD-523_REDUCED]
D13  NSR05T40XV2  [STM_SOD-523_REDUCED]
D14  NSR05T40XV2  [STM_SOD-523_REDUCED]
D401  value TPD1E10B09DPY  Rating: ±9.5V  [TI_DPY_R-PX1SON-N2]  (hidden comment: TPD1E10B09)
D402  value TPD1E10B09DPY  Rating: ±9.5V  [TI_DPY_R-PX1SON-N2]  (hidden comment: TPD1E10B09)
D403  value TPD1E10B09DPY  Rating: ±9.5V  [TI_DPY_R-PX1SON-N2]  (hidden comment: TPD1E10B09)
D404  value TPD1E10B09DPY  Rating: ±9.5V  [TI_DPY_R-PX1SON-N2]  (hidden comment: TPD1E10B09)
D405  value TPD1E10B09DPY  Rating: ±9.5V  [TI_DPY_R-PX1SON-N2]  (hidden comment: TPD1E10B09)
D406  value TPD1E10B09DPY  Rating: ±9.5V  [TI_DPY_R-PX1SON-N2]  (hidden comment: TPD1E10B09)
D407  value TPD1E10B09DPY  Rating: ±9.5V  [TI_DPY_R-PX1SON-N2]  (hidden comment: TPD1E10B09)
D408  value TPD1E10B09DPY  Rating: ±9.5V  [TI_DPY_R-PX1SON-N2]  (hidden comment: TPD1E10B09)
D409  value TPD1E10B09DPY  Rating: ±9.5V  [TI_DPY_R-PX1SON-N2]  (hidden comment: TPD1E10B09)
D410  value TPD1E10B09DPY  Rating: ±9.5V  [TI_DPY_R-PX1SON-N2]  (hidden comment: TPD1E10B09)
D411  value TPD1E10B09DPY  Rating: ±9.5V  [TI_DPY_R-PX1SON-N2]  (hidden comment: TPD1E10B09)
D412  value TPD1E10B09DPY  Rating: ±9.5V  [TI_DPY_R-PX1SON-N2]  (hidden comment: TPD1E10B09)
D413  value TPD1E10B09DPY  Rating: ±9.5V  [TI_DPY_R-PX1SON-N2]  (hidden comment: TPD1E10B09)
D414  value TPD1E10B09DPY  Rating: ±9.5V  [TI_DPY_R-PX1SON-N2]  (hidden comment: TPD1E10B09)
D415  value TPD1E10B09DPY  Rating: ±9.5V  [TI_DPY_R-PX1SON-N2]  (hidden comment: TPD1E10B09)
D416  value TPD1E10B09DPY  Rating: ±9.5V  [TI_DPY_R-PX1SON-N2]  (hidden comment: TPD1E10B09)
D417  value TPD1E10B09DPY  Rating: ±9.5V  [TI_DPY_R-PX1SON-N2]  (hidden comment: TPD1E10B09)
D418  value TPD1E10B09DPY  Rating: ±9.5V  [TI_DPY_R-PX1SON-N2]  (hidden comment: TPD1E10B09)
D501  NSR05T40XV2  [STM_SOD-523_REDUCED]
D502  NSR0130P2T5G  [ONSC_SOD-923_CASE514AB]
D503  NSR0130P2T5G  [ONSC_SOD-923_CASE514AB]
D504  NSR05T40XV2  [STM_SOD-523_REDUCED]
D505  NSR05T40XV2  [STM_SOD-523_REDUCED]
D506  NSR05T40XV2  [STM_SOD-523_REDUCED]
D507  NSR05T40XV2  [STM_SOD-523_REDUCED]
D508  NSR0130P2T5G  [ONSC_SOD-923_CASE514AB]
F1  value 750mA  [LITTELFUSE_440series_1206_REDUCED]  (hidden comment: 0440.750WR)
F2  value 750mA  [LITTELFUSE_440series_1206_REDUCED]  (hidden comment: 0440.750WR)
J1  Kovar Block  [KOVAR_BLOCK_PAD_1.53MM]
J2  Kovar Block  [KOVAR_BLOCK_PAD_1.53MM]
J3  Kovar Block  [KOVAR_BLOCK_PAD_1.53MM]
J4  Kovar Block  [KOVAR_BLOCK_PAD_1.53MM]
J5  Coil Pad  [FEEDHOLE_20mil]
J6  Coil Pad  [FEEDHOLE_20mil]
J401  value FT pad  [FEEDHOLE_20mil]  (hidden comment: THPAD_20m)  (no BOM)
J402  value FT pad  [FEEDHOLE_20mil]  (hidden comment: THPAD_20m)  (no BOM)
J403  value FT pad  [FEEDHOLE_20mil]  (hidden comment: THPAD_20m)  (no BOM)
J404  value FT pad  [FEEDHOLE_20mil]  (hidden comment: THPAD_20m)  (no BOM)
J405  value FT pad  [FEEDHOLE_20mil]  (hidden comment: THPAD_20m)  (no BOM)
J406  value FT pad  [FEEDHOLE_20mil]  (hidden comment: THPAD_20m)  (no BOM)
J407  value FT pad  [FEEDHOLE_20mil]  (hidden comment: THPAD_20m)  (no BOM)
J408  value FT pad  [FEEDHOLE_20mil]  (hidden comment: THPAD_20m)  (no BOM)
J409  value FT pad  [FEEDHOLE_20mil]  (hidden comment: THPAD_20m)  (no BOM)
J410  value FT pad  [FEEDHOLE_20mil]  (hidden comment: THPAD_20m)  (no BOM)
J411  value FT pad  [FEEDHOLE_20mil]  (hidden comment: THPAD_20m)  (no BOM)
J412  value FT pad  [FEEDHOLE_20mil]  (hidden comment: THPAD_20m)  (no BOM)
J413  value FT pad  [FEEDHOLE_20mil]  (hidden comment: THPAD_20m)  (no BOM)
J414  value FT pad  [FEEDHOLE_20mil]  (hidden comment: THPAD_20m)  (no BOM)
J415  value FT pad  [FEEDHOLE_20mil]  (hidden comment: THPAD_20m)  (no BOM)
J416  value FT pad  [FEEDHOLE_20mil]  (hidden comment: THPAD_20m)  (no BOM)
J417  value FT pad  [FEEDHOLE_20mil]  (hidden comment: THPAD_20m)  (no BOM)
J418  value FT pad  [FEEDHOLE_20mil]  (hidden comment: THPAD_20m)  (no BOM)
J419  value FT pad  [FEEDHOLE_20mil]  (hidden comment: THPAD_20m)  (no BOM)
J501  Coil Pad  [FEEDHOLE_20mil]
J502  Coil Pad  [FEEDHOLE_20mil]
J901  Header 4  [SAMTEC_TMS-104-01-G-S]
J902  Header 4  [SAMTEC_TMS-104-01-G-S]
J905  Header 4  [SAMTEC_TMS-104-01-G-S]
J906  Header 6  [SAMTEC_TMS-106-01-G-S]  (no BOM)
J907  Header 6  [SAMTEC_TMS-106-01-G-S]
J908  Header 6  [SAMTEC_TMS-106-01-G-S]  (no BOM)
J909  Header 6  [SAMTEC_TMS-106-01-G-S]
J910  1.27 mm, 2x5, Male, TH  [SAMTEC_FTSH-105-01-XXX-D-K]
J911  1.27 mm, 2x5, Male, TH  [SAMTEC_FTSH-105-01-XXX-D-K]
L1  value DNP  [RES0402_REDUCED]  (hidden comment: Inductor, DNP, 0402)  (no BOM)
L2  value DNP  [RES0402_REDUCED]  (hidden comment: Inductor, DNP, 0402)  (no BOM)
L3  value 10uH  [WURTH_74438323100_REDUCED]  (hidden comment: 74438323100)
L5  value 2.2uH  [TDK_VLS252010HBX-1]  (hidden comment: VLS252010HBX-2R2M-1)
L6  value 33nH  [MURATA_LQG15HS]  (hidden comment: LQG15HS33NJ02D)
L97  value TBD  [MURATA_LQG15HS_0.52mm_0.49mm]  (hidden comment: Inductor, TBD, 0402)
L98  value TBD  [MURATA_LQG15HS_0.52mm_0.49mm]  (hidden comment: Inductor, TBD, 0402)
L99  value DNP  [MURATA_LQG15HS_REDUCED]  (hidden comment: Inductor, DNP, 0402)
L501  value 10uH  [WURTH_74438323100_REDUCED]  (hidden comment: 74438323100)
M1  value DMP21D5UFB4  [DIODESINC_X2-DFN1006-3_REDUCED]  (hidden comment: DMP21D5UFB4-7B)
M2  value DMP21D5UFB4  [DIODESINC_X2-DFN1006-3_REDUCED]  (hidden comment: DMP21D5UFB4-7B)
M3  DMN2990UFZ  [DIODESINC_X2-DFN0606-3]
M4  DMN2990UFZ  [DIODESINC_X2-DFN0606-3]
M5  value DMP21D5UFB4  [DIODESINC_X2-DFN1006-3_REDUCED]  (hidden comment: DMP21D5UFB4-7B)
M6  DMN2990UFZ  [DIODESINC_X2-DFN0606-3]
M7  DMN2990UFZ  [DIODESINC_X2-DFN0606-3]
M8  DMN2990UFZ  [DIODESINC_X2-DFN0606-3]
M9  value DMP2043UCA3  [DIODESINC_X2-DSN1010-3_CUSTOMPIN]  (hidden comment: DMP2043UCA3-7)
M10  value DMP2043UCA3  [DIODESINC_X2-DSN1010-3_CUSTOMPIN]  (hidden comment: DMP2043UCA3-7)
M11  DMN2990UFZ  [DIODESINC_X2-DFN0606-3]
M12  DMN2990UFZ  [DIODESINC_X2-DFN0606-3]
M13  value DMP21D5UFB4  [DIODESINC_X2-DFN1006-3_REDUCED]  (hidden comment: DMP21D5UFB4-7B)
M14  DMN2990UFZ  [DIODESINC_X2-DFN0606-3]
M15  DMN2990UFZ  [DIODESINC_X2-DFN0606-3]
M16  DMN2990UFZ  [DIODESINC_X2-DFN0606-3]
M17  value DMP2043UCA3  [DIODESINC_X2-DSN1010-3_CUSTOMPIN]  (hidden comment: DMP2043UCA3-7)
M18  value DMP2043UCA3  [DIODESINC_X2-DSN1010-3_CUSTOMPIN]  (hidden comment: DMP2043UCA3-7)
M19  DMN2990UFZ  [DIODESINC_X2-DFN0606-3]
M20  DMN2990UFZ  [DIODESINC_X2-DFN0606-3]
M21  value DMP21D5UFB4  [DIODESINC_X2-DFN1006-3_REDUCED]  (hidden comment: DMP21D5UFB4-7B)
M22  value DMP21D5UFB4  [DIODESINC_X2-DFN1006-3_REDUCED]  (hidden comment: DMP21D5UFB4-7B)
M23  DMN2990UFZ  [DIODESINC_X2-DFN0606-3]
M24  value DMP21D5UFB4  [DIODESINC_X2-DFN1006-3_REDUCED]  (hidden comment: DMP21D5UFB4-7B)
M25  DMN2990UFZ  [DIODESINC_X2-DFN0606-3]
M26  DMN2990UFZ  [DIODESINC_X2-DFN0606-3]
M27  value DMP21D5UFB4  [DIODESINC_X2-DFN1006-3_REDUCED]  (hidden comment: DMP21D5UFB4-7B)
M28  value DMP21D5UFB4  [DIODESINC_X2-DFN1006-3_REDUCED]  (hidden comment: DMP21D5UFB4-7B)
M29  DMN2990UFZ  [DIODESINC_X2-DFN0606-3]
M30  value DMP21D5UFB4  [DIODESINC_X2-DFN1006-3_REDUCED]  (hidden comment: DMP21D5UFB4-7B)
M31  DMN2990UFZ  [DIODESINC_X2-DFN0606-3]
M32  DMP58D0LFB  [DIODESINC_X1-DFN1006-3]
M33  DMP22D4UFO  [DIODESINC_X2-DFN0604-3]
M34  value DMN62D1LFB  [DIODESINC_X1-DFN1006-3]  (hidden comment: DMN62D1LFB-7B)
M91  DMP22D4UFO  [DIODESINC_X2-DFN0604-3]
M301  value DMN65D8LFB  Rating: 60V  [DIODESINC_X1-DFN1006-3]  (hidden comment: DMN65D8LFB-7B)
M302  value DMN65D8LFB  Rating: 60V  [DIODESINC_X1-DFN1006-3]  (hidden comment: DMN65D8LFB-7B)
M303  value DMN65D8LFB  Rating: 60V  [DIODESINC_X1-DFN1006-3]  (hidden comment: DMN65D8LFB-7B)
M304  value DMN65D8LFB  Rating: 60V  [DIODESINC_X1-DFN1006-3]  (hidden comment: DMN65D8LFB-7B)
M317  value DMN65D8LFB  Rating: 60V  [DIODESINC_X1-DFN1006-3]  (hidden comment: DMN65D8LFB-7B)
M318  DMP22D4UFO  [DIODESINC_X2-DFN0604-3]
M319  DMN2990UFZ  [DIODESINC_X2-DFN0606-3]
M501  value DMN62D1LFB  [DIODESINC_X1-DFN1006-3]  (hidden comment: DMN62D1LFB-7B)
M502  value DMN62D1LFB  [DIODESINC_X1-DFN1006-3]  (hidden comment: DMN62D1LFB-7B)
M503  value DMN62D1LFB  [DIODESINC_X1-DFN1006-3]  (hidden comment: DMN62D1LFB-7B)
M504  DMP58D0LFB  [DIODESINC_X1-DFN1006-3]
M505  value DMN62D1LFB  [DIODESINC_X1-DFN1006-3]  (hidden comment: DMN62D1LFB-7B)
M506  value DMP2043UCA3  [DIODESINC_X2-DSN1010-3_CUSTOMPIN]  (hidden comment: DMP2043UCA3-7)
M507  DMP58D0LFB  [DIODESINC_X1-DFN1006-3]
M508  DMP58D0LFB  [DIODESINC_X1-DFN1006-3]
M509  DMN62D1SFB  [DIODESINC_X1-DFN1006-3]
M510  DMP58D0LFB  [DIODESINC_X1-DFN1006-3]
M511  DMN62D1SFB  [DIODESINC_X1-DFN1006-3]
M512  DMN62D1SFB  [DIODESINC_X1-DFN1006-3]
M513  DMN62D1SFB  [DIODESINC_X1-DFN1006-3]
M514  DMN62D1SFB  [DIODESINC_X1-DFN1006-3]
M515  DMN2501UFB4  [DIODESINC_X1-DFN1006-3]
Q301  Rating: -40V  [DIODESINC_SOT-963-6]  (hidden comment: NST3906DP6T5G)
Q302  Rating: -40V  [DIODESINC_SOT-963-6]  (hidden comment: NST3906DP6T5G)
Q303  Rating: -40V  [DIODESINC_SOT-963-6]  (hidden comment: NST3906DP6T5G)
Q304  Rating: -40V  [DIODESINC_SOT-963-6]  (hidden comment: NST3906DP6T5G)
Q317  Rating: -40V  [DIODESINC_SOT-963-6]  (hidden comment: NST3906DP6T5G)
Q318  value BC847BLP  Rating: 45V  [DIODESINC_X1-DFN1006-3]  (hidden comment: BC847BLP-7B)
Q321  value BC847BLP  Rating: 45V  [DIODESINC_X1-DFN1006-3]  (hidden comment: BC847BLP-7B)
Q322  value BC847BLP  Rating: 45V  [DIODESINC_X1-DFN1006-3]  (hidden comment: BC847BLP-7B)
Q323  value BC847BLP  Rating: 45V  [DIODESINC_X1-DFN1006-3]  (hidden comment: BC847BLP-7B)
Q324  value BC847BLP  Rating: 45V  [DIODESINC_X1-DFN1006-3]  (hidden comment: BC847BLP-7B)
Q337  value BC847BLP  Rating: 45V  [DIODESINC_X1-DFN1006-3]  (hidden comment: BC847BLP-7B)
R1  value 10.0M  [RES0402_REDUCED]  (hidden comment: WA20SM-1005F-NS62TRX)
R2  value 10.0M  [RES0402_REDUCED]  (hidden comment: WA20SM-1005F-NS62TRX)
R3  value 5.10M  [RES0402_REDUCED]  (hidden comment: WA20SM-5104F-NS62TRX)
R4  value 10.0M  [RES0402_REDUCED]  (hidden comment: WA20SM-1005F-NS62TRX)
R5  value 10.0k  [RES0402_REDUCED]  (hidden comment: WA20SM-1002F-NS62TRX)
R6  value 10.0M  [RES0402_REDUCED]  (hidden comment: WA20SM-1005F-NS62TRX)
R7  value 10.0M  [RES0402_REDUCED]  (hidden comment: WA20SM-1005F-NS62TRX)
R8  value 4.02k  [RES0402_REDUCED]  (hidden comment: WA20SM-4021F-NS62TRX)
R9  value 7.50k  [RES0402_REDUCED]  (hidden comment: WA20SM-7501F-NS62TRX)
R10  value 619k  Rating: 0.1%  [RES0402_REDUCED]  (hidden comment: MCS0402MD6193BE000)
R11  value 243k  Rating: 0.1%  [RES0402_REDUCED]  (hidden comment: RP73PF1E243KBTDF)
R12  value 1.00M  [RES0402_REDUCED]  (hidden comment: WA20SM-1004F-NS62TRX)
R13  value 10.0M  [RES0402_REDUCED]  (hidden comment: WA20SM-1005F-NS62TRX)
R14  value 1.00M  [RES0402_REDUCED]  (hidden comment: WA20SM-1004F-NS62TRX)
R15  value 10.0M  [RES0402_REDUCED]  (hidden comment: WA20SM-1005F-NS62TRX)
R16  value 4.02k  [RES0402_REDUCED]  (hidden comment: WA20SM-4021F-NS62TRX)
R17  value 7.50k  [RES0402_REDUCED]  (hidden comment: WA20SM-7501F-NS62TRX)
R18  value 619k  Rating: 0.1%  [RES0402_REDUCED]  (hidden comment: MCS0402MD6193BE000)
R19  value 243k  Rating: 0.1%  [RES0402_REDUCED]  (hidden comment: RP73PF1E243KBTDF)
R20  value 1.00M  [RES0402_REDUCED]  (hidden comment: WA20SM-1004F-NS62TRX)
R21  value 10.0M  [RES0402_REDUCED]  (hidden comment: WA20SM-1005F-NS62TRX)
R22  value 1.00M  [RES0402_REDUCED]  (hidden comment: WA20SM-1004F-NS62TRX)
R23  value 1.00M  [RES0402_REDUCED]  (hidden comment: WA20SM-1004F-NS62TRX)
R24  value 1.00M  [RES0402_REDUCED]  (hidden comment: WA20SM-1004F-NS62TRX)
R25  value 2.00M  [RES0402_REDUCED]  (hidden comment: WA20SM-2004F-NS62TRX)
R26  value 1.00M  [RES0402_REDUCED]  (hidden comment: WA20SM-1004F-NS62TRX)
R27  value 1.00M  [RES0402_REDUCED]  (hidden comment: WA20SM-1004F-NS62TRX)
R28  value 2.00M  [RES0402_REDUCED]  (hidden comment: WA20SM-2004F-NS62TRX)
R29  value 1.00M  [RES0402_REDUCED]  (hidden comment: WA20SM-1004F-NS62TRX)
R30  value Zero  [RES0402_REDUCED]  (hidden comment: WAJ20PG-NS62TRX)
R31  value DNP  [RES0402_REDUCED]  (hidden comment: Resistor, DNP, 0402)
R32  value 1.00M  [RES0402_REDUCED]  (hidden comment: WA20SM-1004F-NS62TRX)
R33  value 5.10M  [RES0402_REDUCED]  (hidden comment: WA20SM-5104F-NS62TRX)
R34  value 10.0k  [RES0402_REDUCED]  (hidden comment: WA20SM-1002F-NS62TRX)
R35  value 100  [RES0402_REDUCED]  (hidden comment: WA20SM-1000F-NS62TRX)
R36  value 10.0M  [RES0402_REDUCED]  (hidden comment: WA20SM-1005F-NS62TRX)
R37  value 10.0M  [RES0402_REDUCED]  (hidden comment: WA20SM-1005F-NS62TRX)
R38  value 340k  [RES0402_REDUCED]  (hidden comment: WA20SM-3403F-NS62TRX)
R39  value 40.2k  [RES0402_REDUCED]  (hidden comment: WA20SM-4022F-NS62TRX)
R40  value 10.0M  [RES0402_REDUCED]  (hidden comment: WA20SM-1005F-NS62TRX)
R41  value 10.0M  [RES0402_REDUCED]  (hidden comment: WA20SM-1005F-NS62TRX)
R42  value 10.0M  [RES0402_REDUCED]  (hidden comment: WA20SM-1005F-NS62TRX)
R43  value 10.0M  [RES0402_REDUCED]  (hidden comment: WA20SM-1005F-NS62TRX)
R44  value 150k  [RES0402_REDUCED]  (hidden comment: WA20SM-1503F-NS62TRX)
R45  value 49.9k  [RES0402_REDUCED]  (hidden comment: WA20SM-4992F-NS62TRX)
R46  value 49.9k  [RES0402_REDUCED]  (hidden comment: WA20SM-4992F-NS62TRX)
R47  value Zero  [RES0402_REDUCED]  (hidden comment: WAJ20PG-NS62TRX)
R48  value Zero  [RES0402_REDUCED]  (hidden comment: WAJ20PG-NS62TRX)
R49  value DNP  [RES0402_REDUCED]  (hidden comment: Resistor, DNP, 0402)
R50  value DNP  [RES0402_REDUCED]  (hidden comment: Resistor, DNP, 0402)
R51  value 10.0k  [RES0402_REDUCED]  (hidden comment: WA20SM-1002F-NS62TRX)
R52  value 10.0k  [RES0402_REDUCED]  (hidden comment: WA20SM-1002F-NS62TRX)
R53  value 10.0k  [RES0402_REDUCED]  (hidden comment: WA20SM-1002F-NS62TRX)
R54  value 10.0k  [RES0402_REDUCED]  (hidden comment: WA20SM-1002F-NS62TRX)
R55  value 10.0k  [RES0402_REDUCED]  (hidden comment: WA20SM-1002F-NS62TRX)
R201  value 10.0M  [RES0402_REDUCED]  (hidden comment: WA20SM-1005F-NS62TRX)
R202  value 10.0M  [RES0402_REDUCED]  (hidden comment: WA20SM-1005F-NS62TRX)
R203  value 180k  [RES0402_REDUCED]  (hidden comment: RK73H1ETTP1803F)
R204  value 180k  [RES0402_REDUCED]  (hidden comment: RK73H1ETTP1803F)
R205  value 360k  [RES0402_REDUCED]  (hidden comment: WA20SM-3603F-NS62TRX)
R206  value 1.40M  [RES0402_REDUCED]  (hidden comment: WA20SM-1404F-NS62TRX)
R207  value 10.0M  [RES0402_REDUCED]  (hidden comment: WA20SM-1005F-NS62TRX)
R208  value 10.0M  [RES0402_REDUCED]  (hidden comment: WA20SM-1005F-NS62TRX)
R209  value 1.00M  [RES0402_REDUCED]  (hidden comment: WA20SM-1004F-NS62TRX)
R210  value 1.00M  [RES0402_REDUCED]  (hidden comment: WA20SM-1004F-NS62TRX)
R211  value 249k  [RES0402_REDUCED]  (hidden comment: WA20SM-2493F-NS62TRX)
R212  value 1.00M  [RES0402_REDUCED]  (hidden comment: WA20SM-1004F-NS62TRX)
R213  value 10.0M  [RES0402_REDUCED]  (hidden comment: WA20SM-1005F-NS62TRX)
R214  value 10.0M  [RES0402_REDUCED]  (hidden comment: WA20SM-1005F-NS62TRX)
R215  value Zero  [RES0402_REDUCED]  (hidden comment: WAJ20PG-NS62TRX)
R241  value 10.0M  [RES0402_REDUCED]  (hidden comment: WA20SM-1005F-NS62TRX)
R242  value 10.0M  [RES0402_REDUCED]  (hidden comment: WA20SM-1005F-NS62TRX)
R243  value 180k  [RES0402_REDUCED]  (hidden comment: RK73H1ETTP1803F)
R244  value 180k  [RES0402_REDUCED]  (hidden comment: RK73H1ETTP1803F)
R245  value 360k  [RES0402_REDUCED]  (hidden comment: WA20SM-3603F-NS62TRX)
R246  value 1.40M  [RES0402_REDUCED]  (hidden comment: WA20SM-1404F-NS62TRX)
R247  value 10.0M  [RES0402_REDUCED]  (hidden comment: WA20SM-1005F-NS62TRX)
R248  value 10.0M  [RES0402_REDUCED]  (hidden comment: WA20SM-1005F-NS62TRX)
R249  value 1.00M  [RES0402_REDUCED]  (hidden comment: WA20SM-1004F-NS62TRX)
R250  value 1.00M  [RES0402_REDUCED]  (hidden comment: WA20SM-1004F-NS62TRX)
R251  value 100k  [RES0402_REDUCED]  (hidden comment: WA20SM-1003F-NS62TRX)
R252  value 1.00M  [RES0402_REDUCED]  (hidden comment: WA20SM-1004F-NS62TRX)
R253  value 10.0M  [RES0402_REDUCED]  (hidden comment: WA20SM-1005F-NS62TRX)
R254  value 10.0M  [RES0402_REDUCED]  (hidden comment: WA20SM-1005F-NS62TRX)
R255  value Zero  [RES0402_REDUCED]  (hidden comment: WAJ20PG-NS62TRX)
R276  value 1.00M  [RES0402_REDUCED]  (hidden comment: WA20SM-1004F-NS62TRX)
R277  value 100  [RES0402_REDUCED]  (hidden comment: ERJ-2RKF1000X)
R278  value 1.00k  [RES0402_REDUCED]  (hidden comment: ERJ-2RKF1001X)
R279  value 1.00M  [RES0402_REDUCED]  (hidden comment: WA20SM-1004F-NS62TRX)
R281  value DNP  [RES0402_REDUCED]  (hidden comment: Resistor, DNP, 0402)
R282  value DNP  [RES0402_REDUCED]  (hidden comment: Resistor, DNP, 0402)
R283  value DNP  [RES0402_REDUCED]  (hidden comment: Resistor, DNP, 0402)
R284  value DNP  [RES0402_REDUCED]  (hidden comment: Resistor, DNP, 0402)
R297  value DNP  [RES0402_REDUCED]  (hidden comment: Resistor, DNP, 0402)
R298  value 10.0k  [RES0402_REDUCED]  (hidden comment: WA20SM-1002F-NS62TRX)
R299  value DNP  [RES0402_REDUCED]  (hidden comment: Resistor, DNP, 0402)
R300  value Zero  [RES0402_REDUCED]  (hidden comment: WAJ20PG-NS62TRX)
R301  value TBD  [RES0402_REDUCED]  (hidden comment: Resistor. TBD, 0402)
R302  value TBD  [RES0402_REDUCED]  (hidden comment: Resistor. TBD, 0402)
R303  value 100k  [RES0402_REDUCED]  (hidden comment: WA20SM-1003F-NS62TRX)
R304  value 100k  [RES0402_REDUCED]  (hidden comment: WA20SM-1003F-NS62TRX)
R305  value TBD  [RES0402_REDUCED]  (hidden comment: Resistor. TBD, 0402)
R306  value TBD  [RES0402_REDUCED]  (hidden comment: Resistor. TBD, 0402)
R307  value Zero  [RES0402_REDUCED]  (hidden comment: WAJ20PG-NS62TRX)
R308  value Zero  [RES0402_REDUCED]  (hidden comment: WAJ20PG-NS62TRX)
R309  value 10.0M  [RES0402_REDUCED]  (hidden comment: WA20SM-1005F-NS62TRX)
R311  value 1.00k  [RES0402_REDUCED]  (hidden comment: ERJ-2RKF1001X)
R312  value 1.00k  [RES0402_REDUCED]  (hidden comment: ERJ-2RKF1001X)
R313  value 1.00k  [RES0402_REDUCED]  (hidden comment: ERJ-2RKF1001X)
R314  value 1.00k  [RES0402_REDUCED]  (hidden comment: ERJ-2RKF1001X)
R327  value 1.00k  [RES0402_REDUCED]  (hidden comment: ERJ-2RKF1001X)
R331  value 40.2  [RES0402_REDUCED]  (hidden comment: ERJ-2RKF40R2X)
R332  value 40.2  [RES0402_REDUCED]  (hidden comment: ERJ-2RKF40R2X)
R333  value 40.2  [RES0402_REDUCED]  (hidden comment: ERJ-2RKF40R2X)
R334  value 40.2  [RES0402_REDUCED]  (hidden comment: ERJ-2RKF40R2X)
R347  value 40.2  [RES0402_REDUCED]  (hidden comment: ERJ-2RKF40R2X)
R351  value 10.0M  [RES0402_REDUCED]  (hidden comment: WA20SM-1005F-NS62TRX)
R352  value 10.0M  [RES0402_REDUCED]  (hidden comment: WA20SM-1005F-NS62TRX)
R353  value 10.0M  [RES0402_REDUCED]  (hidden comment: WA20SM-1005F-NS62TRX)
R354  value 10.0M  [RES0402_REDUCED]  (hidden comment: WA20SM-1005F-NS62TRX)
R367  value 10.0M  [RES0402_REDUCED]  (hidden comment: WA20SM-1005F-NS62TRX)
R371  value 2.00M  [RES0402_REDUCED]  (hidden comment: WA20SM-2004F-NS62TRX)
R372  value 2.00M  [RES0402_REDUCED]  (hidden comment: WA20SM-2004F-NS62TRX)
R373  value 2.00M  [RES0402_REDUCED]  (hidden comment: WA20SM-2004F-NS62TRX)
R374  value 2.00M  [RES0402_REDUCED]  (hidden comment: WA20SM-2004F-NS62TRX)
R387  value 2.00M  [RES0402_REDUCED]  (hidden comment: WA20SM-2004F-NS62TRX)
R501  value 402  [RES0805_L_REDUCED]  (hidden comment: WA20SM-4020F-NS62TRX)
R502  value 1.00M  [RES0402_REDUCED]  (hidden comment: WA20SM-1004F-NS62TRX)
R503  value 1.00M  [RES0402_REDUCED]  (hidden comment: WA20SM-1004F-NS62TRX)
R504  value 1.00M  [RES0402_REDUCED]  (hidden comment: WA20SM-1004F-NS62TRX)
R505  value 49.9  [RES0805_L_REDUCED]  (hidden comment: WA86SM-49R9F-NS62TRX)
R506  value 1.00M  [RES0402_REDUCED]  (hidden comment: WA20SM-1004F-NS62TRX)
R507  value 1.00M  [RES0402_REDUCED]  (hidden comment: WA20SM-1004F-NS62TRX)
R508  value 100k  [RES0402_REDUCED]  (hidden comment: WA20SM-1003F-NS62TRX)
R509  value 1.00M  [RES0402_REDUCED]  (hidden comment: WA20SM-1004F-NS62TRX)
R510  value 1.00M  [RES0402_REDUCED]  (hidden comment: WA20SM-1004F-NS62TRX)
R511  value 402  [RES0805_L_REDUCED]  (hidden comment: WA20SM-4020F-NS62TRX)
R512  value 1.00M  [RES0402_REDUCED]  (hidden comment: WA20SM-1004F-NS62TRX)
R513  value 1.00M  [RES0402_REDUCED]  (hidden comment: WA20SM-1004F-NS62TRX)
R514  value 1.00M  [RES0402_REDUCED]  (hidden comment: WA20SM-1004F-NS62TRX)
R515  value 1.00M  [RES0402_REDUCED]  (hidden comment: WA20SM-1004F-NS62TRX)
R516  value 150k  [RES0402_REDUCED]  (hidden comment: WA20SM-1503F-NS62TRX)
R517  value 1.00M  [RES0402_REDUCED]  (hidden comment: WA20SM-1004F-NS62TRX)
R518  value 1.00M  [RES0402_REDUCED]  (hidden comment: WA20SM-1004F-NS62TRX)
R519  value 1.00M  [RES0402_REDUCED]  (hidden comment: WA20SM-1004F-NS62TRX)
R520  value 40.2k  [RES0402_REDUCED]  (hidden comment: WA20SM-4022F-NS62TRX)
R521  value 1.00M  [RES0402_REDUCED]  (hidden comment: WA20SM-1004F-NS62TRX)
R522  value 100k  [RES0402_REDUCED]  (hidden comment: WA20SM-1003F-NS62TRX)
R523  value 2.00M  [RES0402_REDUCED]  (hidden comment: WA20SM-2004F-NS62TRX)
R524  value DNP  [RES0402_REDUCED]  (hidden comment: Resistor, DNP, 0402)
R525  value 1.00M  [RES0402_REDUCED]  (hidden comment: WA20SM-1004F-NS62TRX)
R526  value 1.00M  [RES0402_REDUCED]  (hidden comment: WA20SM-1004F-NS62TRX)
R527  value DNP  [RES0402_REDUCED]  (hidden comment: Resistor, DNP, 0402)
R528  value 402  [RES0805_L_REDUCED]  (hidden comment: WA20SM-4020F-NS62TRX)
R529  value DNP  [RES0402_REDUCED]  (hidden comment: Resistor, DNP, 0402)
R530  value DNP  [RES0402_REDUCED]  (hidden comment: Resistor, DNP, 0402)
R531  value Zero  [RES0402_REDUCED]  (hidden comment: WAJ20PG-NS62TRX)
SW901  PB  [CK_PTS647]  (value not drawn)
TP1  Test Point  [testpad_0.9mm]  (value not drawn)  (no BOM)
TP2  Test Point  [testpad_0.9mm]  (value not drawn)  (no BOM)
TP3  Test Point  [testpad_0.9mm]  (value not drawn)  (no BOM)
TP4  Test Point  [testpad_0.9mm]  (value not drawn)  (no BOM)
TP5  Test Point  [testpad_0.9mm]  (value not drawn)  (no BOM)
TP6  Test Point  [testpad_0.9mm]  (value not drawn)  (no BOM)
TP7  Test Point  [testpad_0.9mm]  (value not drawn)  (no BOM)
TP8  Test Point  [testpad_0.9mm]  (value not drawn)  (no BOM)
TP9  Test Point  [testpad_0.9mm]  (value not drawn)  (no BOM)
TP10  Test Point  [testpad_0.9mm]  (value not drawn)  (no BOM)
TP11  Test Point  [testpad_0.9mm]  (value not drawn)  (no BOM)
TP12  Test Point  [testpad_0.9mm]  (value not drawn)  (no BOM)
TP13  Test Point  [testpad_0.9mm]  (value not drawn)  (no BOM)
TP14  Test Point  [testpad_0.9mm]  (value not drawn)  (no BOM)
TP15  Test Point  [testpad_0.9mm]  (value not drawn)  (no BOM)
TP16  Test Point  [testpad_0.9mm]  (value not drawn)  (no BOM)
TP17  Test Point  [testpad_0.9mm]  (value not drawn)  (no BOM)
TP18  Test Point  [testpad_0.9mm]  (value not drawn)  (no BOM)
TP19  Test Point  [testpad_0.9mm]  (value not drawn)  (no BOM)
TP20  Test Point  [testpad_0.9mm]  (value not drawn)  (no BOM)
TP21  Test Point  [testpad_0.9mm]  (value not drawn)  (no BOM)
TP22  Test Point  [testpad_0.9mm]  (value not drawn)  (no BOM)
TP23  Test Point  [testpad_0.9mm]  (value not drawn)  (no BOM)
TP24  Test Point  [testpad_0.9mm]  (value not drawn)  (no BOM)
TP25  Test Point  [testpad_0.9mm]  (value not drawn)  (no BOM)
TP26  Test Point  [testpad_0.9mm]  (value not drawn)  (no BOM)
TP27  Test Point  [testpad_0.9mm]  (value not drawn)  (no BOM)
TP28  Test Point  [testpad_0.9mm]  (value not drawn)  (no BOM)
TP29  Test Point  [testpad_0.9mm]  (value not drawn)  (no BOM)
TP30  Test Point  [testpad_0.9mm]  (value not drawn)  (no BOM)
TP31  Test Point  [testpad_0.9mm]  (value not drawn)  (no BOM)
TP32  Test Point  [testpad_0.9mm]  (value not drawn)  (no BOM)
TP33  Test Point  [testpad_0.9mm]  (value not drawn)  (no BOM)
TP34  Test Point  [testpad_0.9mm]  (value not drawn)  (no BOM)
TP35  Test Point  [testpad_0.9mm]  (value not drawn)  (no BOM)
TP36  Test Point  [testpad_0.9mm]  (value not drawn)  (no BOM)
TP37  Test Point  [testpad_0.9mm]  (value not drawn)  (no BOM)
TP38  Test Point  [testpad_0.9mm]  (value not drawn)  (no BOM)
TP39  Test Point  [testpad_0.9mm]  (value not drawn)  (no BOM)
TP40  Test Point  [testpad_0.9mm]  (value not drawn)  (no BOM)
TP41  Test Point  [testpad_0.9mm]  (value not drawn)  (no BOM)
TP42  Test Point  [testpad_0.9mm]  (value not drawn)  (no BOM)
TP43  Test Point  [testpad_0.9mm]  (value not drawn)  (no BOM)
TP44  Test Point  [testpad_0.9mm]  (value not drawn)  (no BOM)
TP45  Test Point  [testpad_0.9mm]  (value not drawn)  (no BOM)
TP46  Test Point  [testpad_0.9mm]  (value not drawn)  (no BOM)
TP47  Test Point  [testpad_0.9mm]  (value not drawn)  (no BOM)
TP48  Test Point  [testpad_0.9mm]  (value not drawn)  (no BOM)
TP49  Test Point  [testpad_0.9mm]  (value not drawn)  (no BOM)
TP81  Test Point  [testpad_0.9mm]  (value not drawn)  (no BOM)
TP82  Test Point  [testpad_0.9mm]  (value not drawn)  (no BOM)
TP83  Test Point  [testpad_0.9mm]  (value not drawn)  (no BOM)
TP84  Test Point  [testpad_0.9mm]  (value not drawn)  (no BOM)
TP85  Test Point  [testpad_0.9mm]  (value not drawn)  (no BOM)
TP86  Test Point  [testpad_0.9mm]  (value not drawn)  (no BOM)
TP90  Test Point  [testpad_0.9mm]  (value not drawn)  (no BOM)
TP91  Test Point  [testpad_0.9mm]  (value not drawn)  (no BOM)
TP92  Test Point  [testpad_0.9mm]  (value not drawn)  (no BOM)
TP93  Test Point  [testpad_0.9mm]  (value not drawn)  (no BOM)
TP94  Test Point  [testpad_0.9mm]  (value not drawn)  (no BOM)
TP95  Test Point  [testpad_0.9mm]  (value not drawn)  (no BOM)
TP96  Test Point  [testpad_0.9mm]  (value not drawn)  (no BOM)
TP97  Test Point  [testpad_0.9mm]  (value not drawn)  (no BOM)
TP98  Test Point  [testpad_0.9mm]  (value not drawn)  (no BOM)
TP99  Test Point  [testpad_0.9mm]  (value not drawn)  (no BOM)
TP301  Test Point  [testpad_0.9mm]  (value not drawn)  (no BOM)
TP303  Test Point  [testpad_0.9mm]  (value not drawn)  (no BOM)
TP304  Test Point  [testpad_0.9mm]  (value not drawn)  (no BOM)
TP305  Test Point  [testpad_0.9mm]  (value not drawn)  (no BOM)
TP306  Test Point  [testpad_0.9mm]  (value not drawn)  (no BOM)
TP307  Test Point  [testpad_0.9mm]  (value not drawn)  (no BOM)
TP501  Test Point  [testpad_0.9mm]  (value not drawn)  (no BOM)
TP502  Test Point  [testpad_0.9mm]  (value not drawn)  (no BOM)
TP503  Test Point  [testpad_0.9mm]  (value not drawn)  (no BOM)
TP504  Test Point  [testpad_0.9mm]  (value not drawn)  (no BOM)
TP505  Test Point  [testpad_0.9mm]  (value not drawn)  (no BOM)
TP506  Test Point  [testpad_0.9mm]  (value not drawn)  (no BOM)
TP507  Test Point  [testpad_0.9mm]  (value not drawn)  (no BOM)
TP508  Test Point  [testpad_0.9mm]  (value not drawn)  (no BOM)
TP509  Test Point  [testpad_0.9mm]  (value not drawn)  (no BOM)
TP510  Test Point  [testpad_0.9mm]  (value not drawn)  (no BOM)
TP511  Test Point  [testpad_0.9mm]  (value not drawn)  (no BOM)
TP512  Test Point  [testpad_0.9mm]  (value not drawn)  (no BOM)
U1  AP7354D-33FS4-7  [DIODESINC_X2-DFN1010-4 (Type B)_REDUCED]
U2  LTC4065LEDC#TRMPBF  [LT_DC6]
U3  TLV4021R1YKAR  [TI_YKA0004]
U4  LTC4065LEDC#TRMPBF  [LT_DC6]
U5  TLV4021R1YKAR  [TI_YKA0004]
U6  AD8505ACBZ  [AD_CB-6-7(WLCSP6)]
U7  AD8505ACBZ  [AD_CB-6-7(WLCSP6)]
U8  BD020-14E  [NVE_ULLGA4]
U9  CY15B108QN-20LPXC  [CY_002-18131_GQFN8]
U10  AP7354D-33FS4-7  [DIODESINC_X2-DFN1010-4 (Type B)_REDUCED]
U11  AP7354D-33FS4-7  [DIODESINC_X2-DFN1010-4 (Type B)_REDUCED]
U12  LT1615ES5-1#TRPBF  [LT_S5_L]
U13  ISL23315TFRUZ-T  [RENESAS_L10.2.1X1.6A_UTQFN10]
U14  AD8505ACBZ  [AD_CB-6-7(WLCSP6)]
U15  AD8505ACBZ  [AD_CB-6-7(WLCSP6)]
U16  AD8505ACBZ  [AD_CB-6-7(WLCSP6)]
U17  STM32U585QII3  [STM_UFBGA132]
U18  TPS3831L30  [TI_X2SON_DQN0004A]
U30  ADG1634BCPZ-REEL7  [AD_CP-20-8]
U31  ADG1634BCPZ-REEL7  [AD_CP-20-8]
U91  NRF52810-CAAA  [NORDIC_WLCSP_2.482x2.464]
U201  AD8233ACBZ  [AD_CB-20-13_WLCSP20]
U203  AD8233ACBZ  [AD_CB-20-13_WLCSP20]
U301  DAC80502DRXT  [TI_DRX0010A]
U303  TS5A3159AYZPR  [TI_YZP6]
U304  TS5A3159AYZPR  [TI_YZP6]
U305  TLV9002SIYCKR  [TI_YCK0009]
U306  SN74LVC1G123YZPR  [TI_YZP0008]
U307  SN74LVC2G08YZPR  [TI_YZP0008]
U308  MAX4781ETE+T  [MAXIM_21-0136]
U309  MAX4781ETE+T  [MAXIM_21-0136]
U310  TLV9002SIYCKR  [TI_YCK0009]
U311  AD8137YCPZ  [AD_CP-8-13]
U501  AD8505ACBZ  [AD_CB-6-7(WLCSP6)]
U502  TLV3691IDCK  [TI_DCK5_REDUCED]
U503  LTC3130IUDC-1  [LT_UDC-20_REDUCED]
X1  FIDUCIAL  [Fid_IPC-7351B]  (no BOM)
X2  FIDUCIAL  [Fid_IPC-7351B]  (no BOM)
X3  FIDUCIAL  [Fid_IPC-7351B]  (no BOM)
X4  FIDUCIAL  [Fid_IPC-7351B]  (no BOM)
X5  FIDUCIAL  [Fid_IPC-7351B]  (no BOM)
X6  FIDUCIAL  [Fid_IPC-7351B]  (no BOM)
X7  HOLE, UNPLATED  [HOLE_UNPLATED_3.5MM]  (no BOM)
X8  HOLE, UNPLATED  [HOLE_UNPLATED_3.5MM]  (no BOM)
X9  HOLE, UNPLATED  [HOLE_UNPLATED_3.5MM]  (no BOM)
Y1  value 32.768kHz  [MICROCRYSTAL_CC8V-T1A]  (hidden comment: CC8V-T1A32.768kHz)
Y2  value 48.0MHz  [MICROCRYSTAL_CC8A-T1A]  (hidden comment: CC8A-T1A48.000MHz)
Y91  value 32.768kHz  [MICROCRYSTAL_CC8V-T1A]  (hidden comment: CC8V-T1A32.768kHz)
Y92  value 32.0MHz  [MICROCRYSTAL_CC8A-T1A]  (hidden comment: CC8A-T1A48.000MHz)